# EAGLE design Intercom (EAGLE 6.6.0)

## Sheet 1 of 3
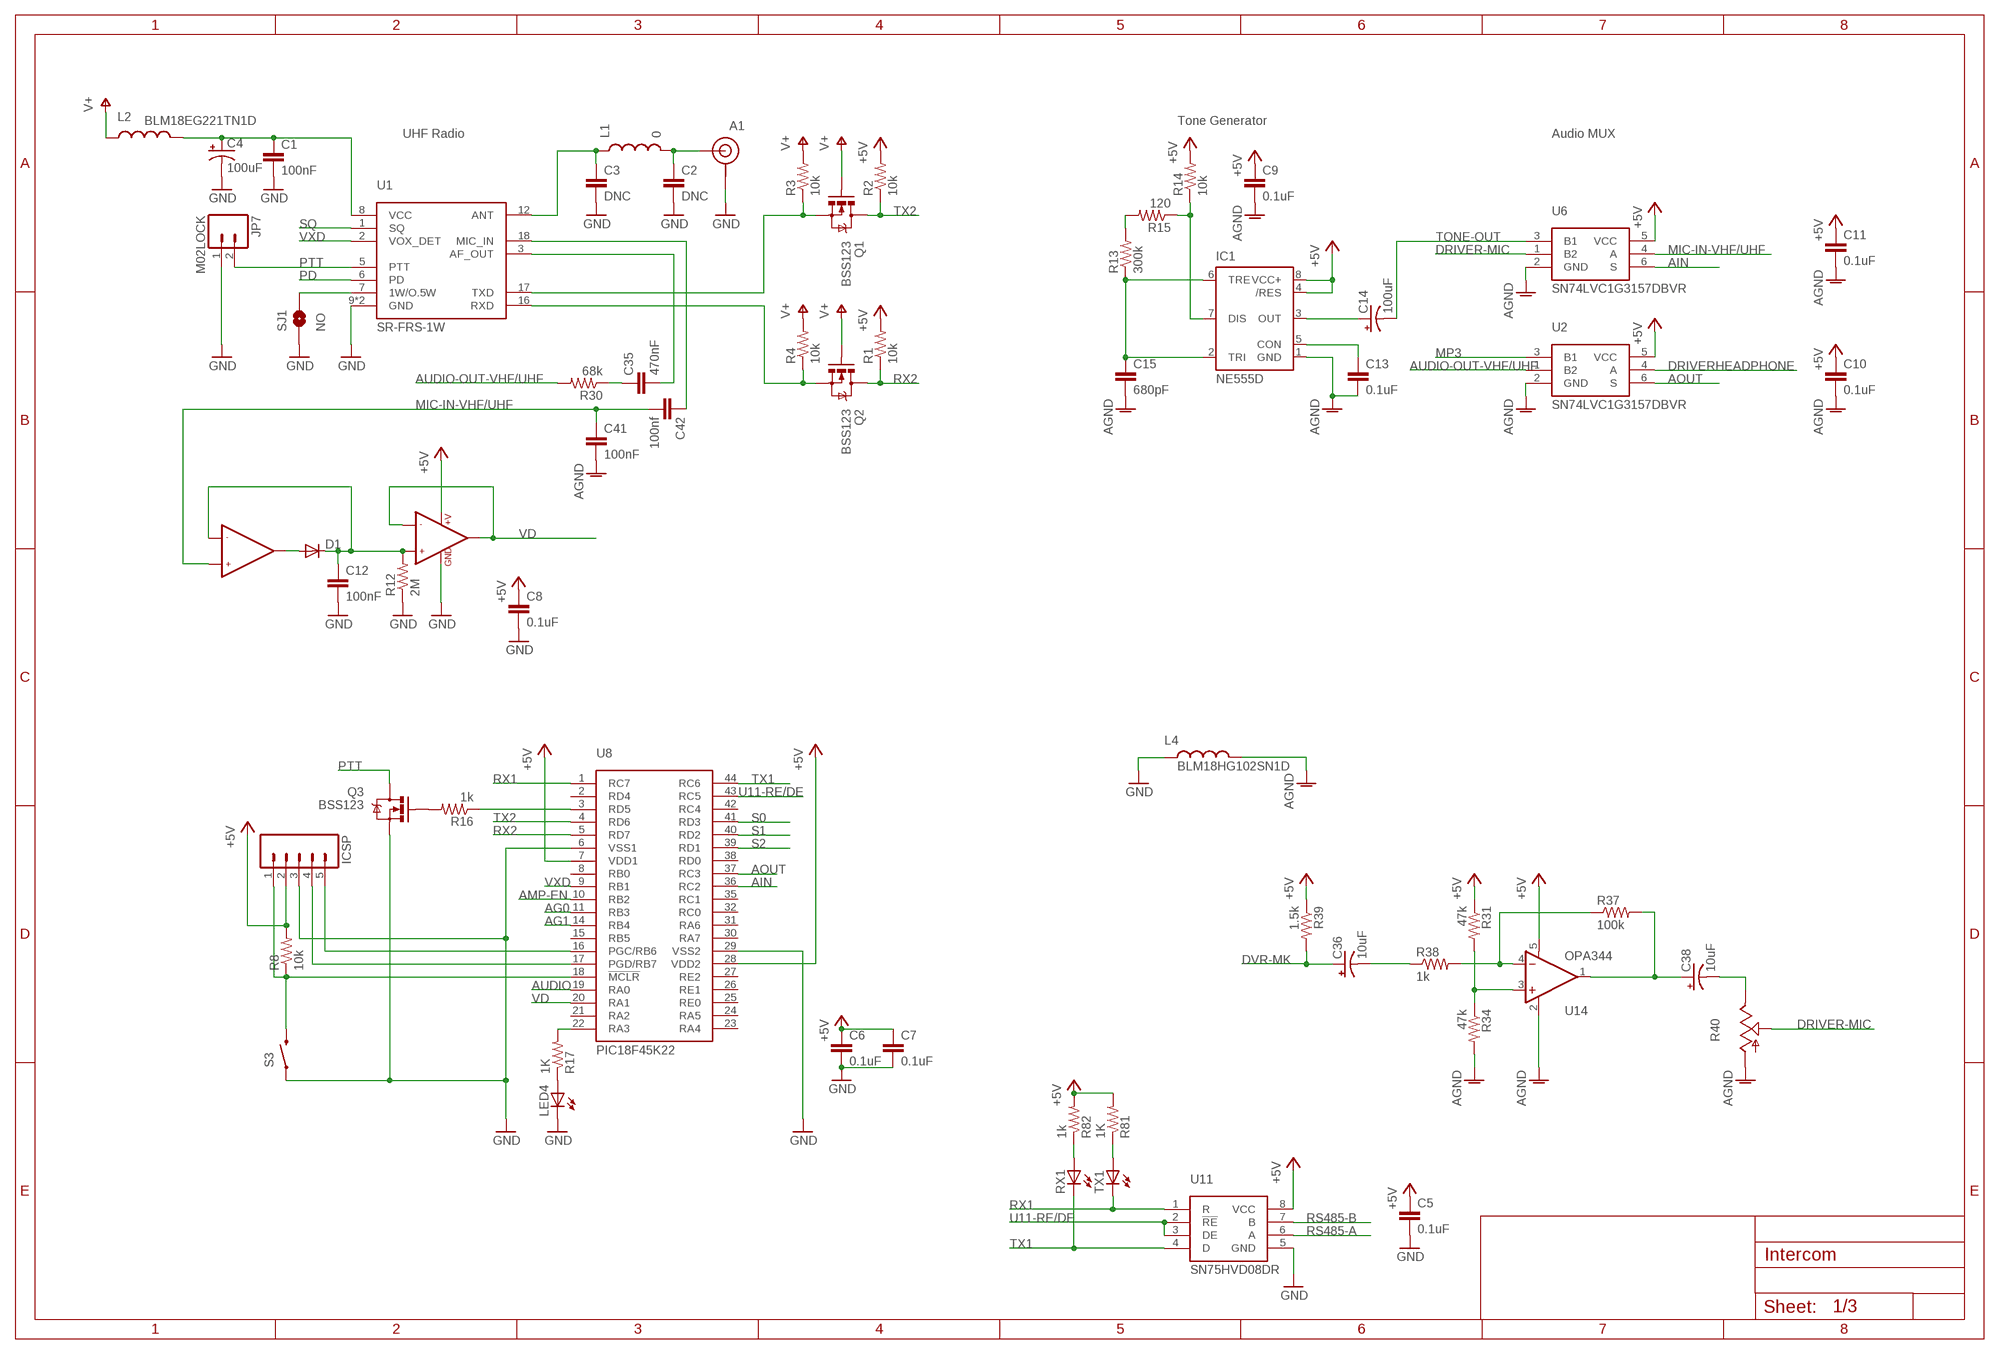
[diagram p0: schematic, sheet 1]

### Parts
A1  CONSMA003.062  [CONSMA003.062]
C1  100nF  CAP0805  [0805]
C2  DNC  CAP0805  [0805]
C3  DNC  CAP0805  [0805]
C4  100uF  CAP_POL1206  [EIA3216]
C5  0.1uF  CAP0805  [0805]
C6  0.1uF  CAP0805  [0805]
C7  0.1uF  CAP0805  [0805]
C8  0.1uF  CAP0805  [0805]
C9  0.1uF  CAP0805  [0805]
C10  0.1uF  CAP0805  [0805]
C11  0.1uF  CAP0805  [0805]
C12  100nF  CAP0805  [0805]
C13  0.1uF  CAP0805  [0805]
C14  100uF  CAP_POL3528-KIT  [EIA3528-KIT]
C15  680pF  CAP0805  [0805]
C35  470nF  CAP0805  [0805]
C36  10uF  CAP_POL1206  [EIA3216]
C38  10uF  CAP_POL1206  [EIA3216]
C41  100nF  CAP0805  [0805]
C42  100nf  CAP0805  [0805]
D1  DIODESOD  [SOD-323]
IC1  NE555D  [SO08]
ICSP  M05LOCK_LONGPADS  [1X05_LOCK_LONGPADS]
JP7  M02LOCK  [1X02_LOCK]
L1  0  INDUCTOR1007  [1007]
L2  BLM18EG221TN1D  INDUCTOR0603  [0603]
L4  BLM18HG102SN1D  INDUCTOR0805  [0805]
LED4  LEDCHIPLED_0805  [CHIPLED_0805]
Q1  BSS123  MOSFET-NCHANNELBSS123LT1G  [SOT23]
Q2  BSS123  MOSFET-NCHANNELBSS123LT1G  [SOT23]
Q3  BSS123  MOSFET-NCHANNELBSS123LT1G  [SOT23]
R1  10k  RESISTOR0805-RES  [0805]
R2  10k  RESISTOR0805-RES  [0805]
R3  10k  RESISTOR0805-RES  [0805]
R4  10k  RESISTOR0805-RES  [0805]
R8  10k  RESISTOR0805-RES  [0805]
R12  2M  RESISTOR0805-RES  [0805]
R13  300k  RESISTOR0805-RES  [0805]
R14  10k  RESISTOR0805-RES  [0805]
R15  120  RESISTOR0805-RES  [0805]
R16  1k  RESISTOR0805-RES  [0805]
R17  1K  R-US_R0805  [R0805]
R30  68k  RESISTOR0805-RES  [0805]
R31  47k  RESISTOR0805-RES  [0805]
R34  47k  RESISTOR0805-RES  [0805]
R37  100k  RESISTOR0805-RES  [0805]
R38  1k  RESISTOR0805-RES  [0805]
R39  1.5k  RESISTOR0805-RES  [0805]
R40  TRIM_US-CA6H  [CA6H]
R81  1K  R-US_R0805  [R0805]
R82  1k  R-US_R0805  [R0805]
RX1  LEDCHIPLED_0805  [CHIPLED_0805]
S3  SWITCH-MOMENTARY-2SIDE_EZ  [TACTILE-PTH-SIDEEZ]
SJ1  NO  SOLDERJUMPERNO  [SJ_2S-NO]
TX1  LEDCHIPLED_0805  [CHIPLED_0805]
U1  SR-FRS-1W  [SR-FRS-1W]
U2  SN74LVC1G3157DBVR  [SOT23-6]
U6  SN74LVC1G3157DBVR  [SOT23-6]
U8  PIC18F45K22  [TQFP-44]
U11  SN75HVD08DR  [SO-8]
U12  LMV358  [SO08]
U14  OPA344  [SOT23-5]

### Nets
+5V: C5.1 C6.1 C7.1 C8.1 C9.1 C10.1 C11.1 IC1.4(/RES) IC1.8(VCC+) ICSP.2 R1.2 R2.2 R8.2 R14.2 R31.1 R39.1 R81.2 R82.2 U2.5(VCC) U6.5(VCC) U8.7(VDD1) U8.28(VDD2) U11.8(VCC) U12.8(+V) U14.5(V+) ; also sheet 3
AG0: U8.11(RB3)
AG1: U8.14(RB4)
AGND: C9.2 C10.2 C11.2 C13.2 C15.2 C41.2 IC1.1(GND) L4.2 R34.2 R40.A U2.2(GND) U6.2(GND) U14.2(V-) ; also sheet 2,3
AIN: U6.6(S) U8.36(RC2)
AMP-EN: U8.10(RB2)
AOUT: U2.6(S) U8.37(RC3)
AUDIO: U8.19(RA0)
AUDIO-OUT-VHF/UHF: R30.2 U2.1(B2)
DRIVER-MIC: R40.S U6.1(B2)
DRIVERHEADPHONE: U2.4(A)
DVR-MK: C36.A(+) R39.2 ; also sheet 3
GND: A1.G1(GND) A1.G2(GND) A1.G3(GND) A1.G(GND) C1.2 C2.2 C3.2 C4.C(-) C5.2 C6.2 C7.2 C8.2 C12.2 ICSP.3 JP7.1 L4.1 LED4.C Q3.2(S) R12.1 S3.1 SJ1.1 U1.9(GND) U1.10(GND) U8.6(VSS1) U8.29(VSS2) U11.5(GND) U12.4(GND) ; also sheet 2,3
MIC-IN-VHF/UHF: C41.1 C42.2 U6.4(A) U12.5(+IN2)
MP3: U2.3(B1) ; also sheet 2
N$1: C3.1 L1.1 U1.12(ANT)
N$2: A1.S(SIGNAL) C2.1 L1.2
N$3: C1.1 C4.A(+) L2.2 U1.8(VCC)
N$4: SJ1.2 U1.7(1W/O.5W)
N$5: D1.2(A) U12.7(OUT2)
N$6: C15.1 IC1.2(TRI) IC1.6(TRE) R13.1
N$8: Q2.2(S) R4.1 U1.16(RXD)
N$9: Q1.2(S) R3.1 U1.17(TXD)
N$14: C35.2 U1.3(AF_OUT)
N$16: R31.2 R34.1 U14.3(+IN)
N$17: C35.1 R30.1
N$19: R16.1 U8.3(RD5)
N$20: C38.C(-) R40.E
N$21: C12.1 D1.1(C) R12.2 U12.3(+IN1) U12.6(-IN2)
N$22: IC1.7(DIS) R14.1 R15.1
N$23: R13.2 R15.2
N$24: C13.1 IC1.5(CON)
N$25: Q3.1(G) R16.2
N$26: C14.A(+) IC1.3(OUT)
N$27: LED4.A R17.1
N$28: R17.2 U8.22(RA3)
N$33: C38.A(+) R37.2 U14.1(OUT)
N$37: R37.1 R38.2 U14.4(-IN)
N$38: C36.C(-) R38.1
N$40: ICSP.4 U8.17(PGD/RB7)
N$43: ICSP.5 U8.16(PGC/RB6)
N$46: ICSP.1 R8.1 S3.2 U8.18(!MCLR)
N$48: C42.1 U1.18(MIC_IN)
N$86: R81.1 TX1.A
N$87: R82.1 RX1.A
PD: U1.6(PD)
PTT: JP7.2 Q3.3(D) U1.5(PTT)
RS485-A: U11.6(A) ; also sheet 3
RS485-B: U11.7(B) ; also sheet 3
RX1: TX1.C U8.1(RC7) U11.1(R)
RX2: Q2.3(D) R1.1 U8.5(RD7)
S0: U8.41(RD3) ; also sheet 2
S1: U8.40(RD2) ; also sheet 2
S2: U8.39(RD1) ; also sheet 2
SQ: U1.1(SQ)
TONE-OUT: C14.C(-) U6.3(B1)
TX1: RX1.C U8.44(RC6) U11.4(D)
TX2: Q1.3(D) R2.1 U8.4(RD6)
U11-RE/DE: U8.43(RC5) U11.2(!RE) U11.3(DE)
V+: L2.1 Q1.1(G) Q2.1(G) R3.2 R4.2 ; also sheet 3
VD: U8.20(RA1) U12.1(OUT1) U12.2(-IN1)
VXD: U1.2(VOX_DET) U8.9(RB1)
Unconnected: U8.2(RD4) U8.8(RB0) U8.15(RB5) U8.21(RA2) U8.23(RA4) U8.24(RA5) U8.25(RE0) U8.26(RE1) U8.27(RE2) U8.30(RA7) U8.31(RA6) U8.32(RC0) U8.35(RC1) U8.38(RD0) U8.42(RC4)

### Notes on the sheet
- Tone Generator
- UHF Radio | Audio MUX

## Sheet 2 of 3
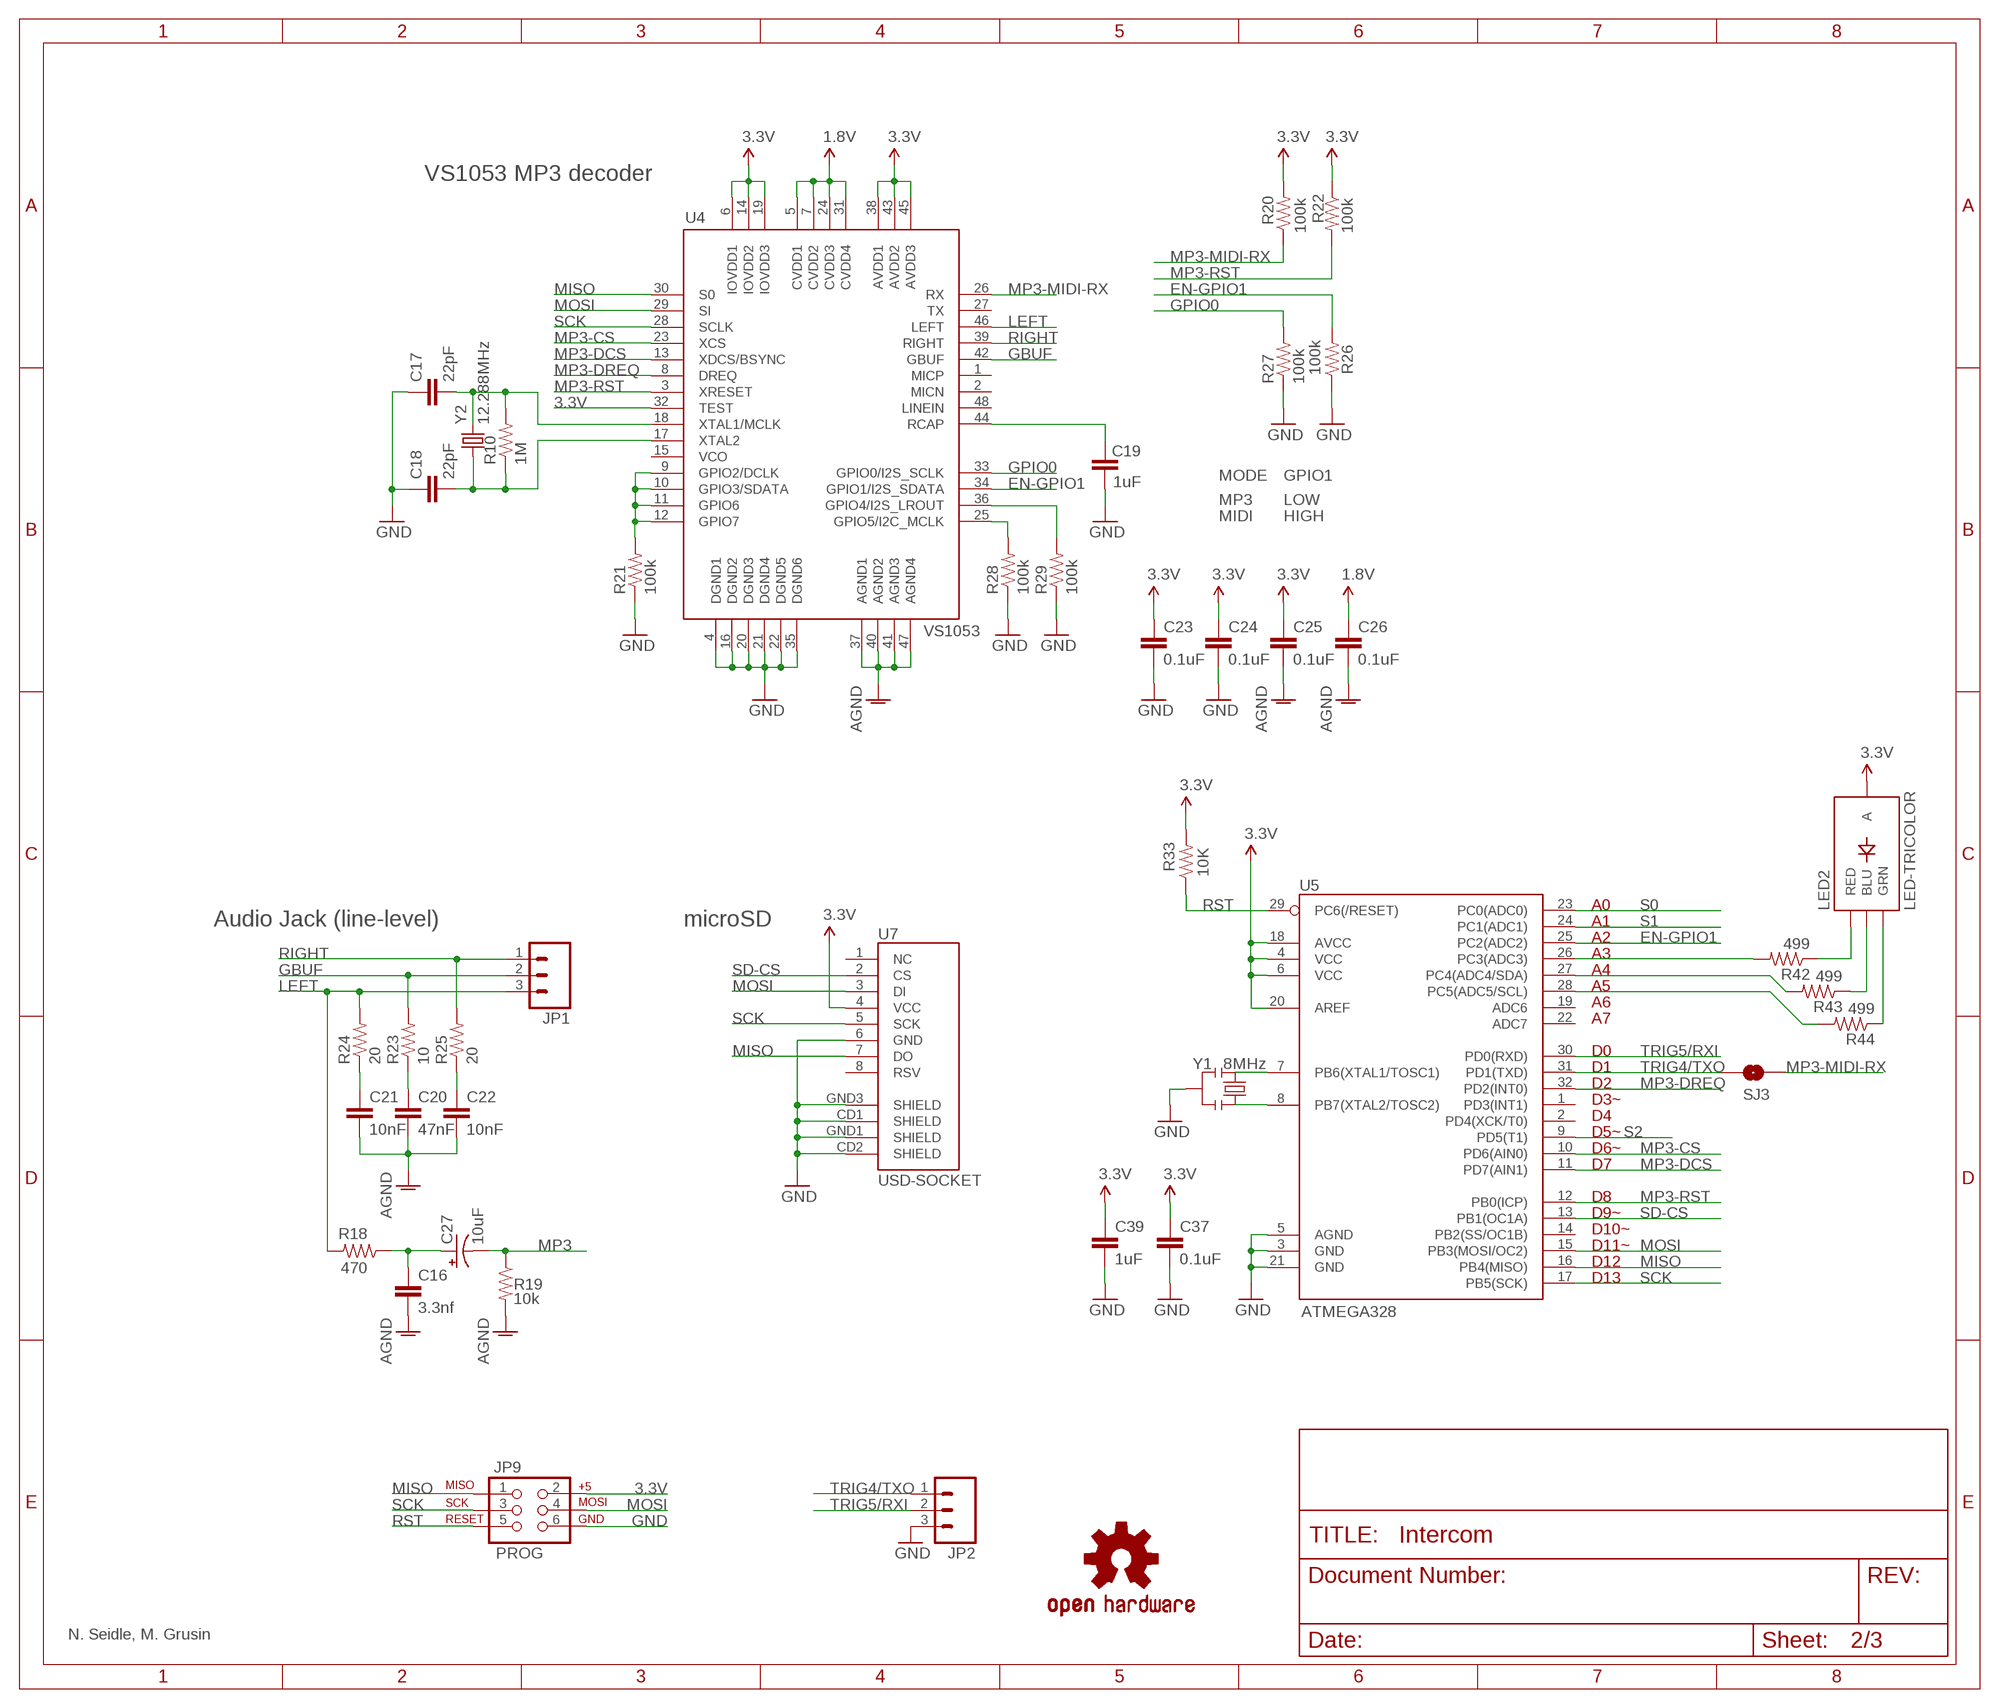
[diagram p1: schematic, sheet 2]

### Parts
C16  3.3nf  CAP0805  [0805]
C17  22pF  CAP0805  [0805]
C18  22pF  CAP0805  [0805]
C19  1uF  CAP0805  [0805]
C20  47nF  CAP0805  [0805]
C21  10nF  CAP0805  [0805]
C22  10nF  CAP0805  [0805]
C23  0.1uF  CAP0805  [0805]
C24  0.1uF  CAP0805  [0805]
C25  0.1uF  CAP0805  [0805]
C26  0.1uF  CAP0805  [0805]
C27  10uF  CPOL-USCT6032  [CT6032]
C37  0.1uF  CAP0805  [0805]
C39  1uF  CAP0805  [0805]
JP1  M03PTH  [1X03]
JP2  M03LOCK_LONGPADS  [1X03_LOCK_LONGPADS]
JP9  PROG  AVR_SPI_PRG_6NS  [2X3-NS]
LED2  LED-TRICOLOR  [LED-TRICOLOR-SMD]
R10  1M  RESISTOR0805-RES  [0805]
R18  470  RESISTOR0805-RES  [0805]
R19  10k  RESISTOR0805-RES  [0805]
R20  100k  RESISTOR0805-RES  [0805]
R21  100k  RESISTOR0805-RES  [0805]
R22  100k  RESISTOR0805-RES  [0805]
R23  10  RESISTOR0805-RES  [0805]
R24  20  RESISTOR0805-RES  [0805]
R25  20  RESISTOR0805-RES  [0805]
R26  100k  RESISTOR0805-RES  [0805]
R27  100k  RESISTOR0805-RES  [0805]
R28  100k  RESISTOR0805-RES  [0805]
R29  100k  RESISTOR0805-RES  [0805]
R33  10K  RESISTOR0805-RES  [0805]
R42  499  RESISTOR0805-RES  [0805]
R43  499  RESISTOR0805-RES  [0805]
R44  499  RESISTOR0805-RES  [0805]
SJ3  SOLDERJUMPERNO  [SJ_2S-NO]
U4  VS1053  VS1033  [LQFP-48]
U5  ATMEGA328  ATMEGA168  [TQFP32-08]
U7  USD-SOCKET  USD-SOCKETNEW  [MICRO-SD-SOCKET-PP]
U$5  OSHW-LOGOM  [OSHW-LOGO-M]
Y1  8MHz  RESONATORSMD  [RESONATOR-SMD]
Y2  12.288MHz  CRYSTAL5X3  [CRYSTAL-SMD-5X3]

### Nets
1.8V: C26.1 U4.5(CVDD1) U4.7(CVDD2) U4.24(CVDD3) U4.31(CVDD4) ; also sheet 3
3.3V: C23.1 C24.1 C25.1 C37.1 C39.1 JP9.2 LED2.A R20.2 R22.1 R33.2 U4.6(IOVDD1) U4.14(IOVDD2) U4.19(IOVDD3) U4.32(TEST) U4.38(AVDD1) U4.43(AVDD2) U4.45(AVDD3) U5.4(VCC) U5.6(VCC) U5.18(AVCC) U5.20(AREF) U7.4(VCC) ; also sheet 3
AGND: C16.2 C20.2 C21.2 C22.2 C25.2 C26.2 R19.2 U4.37(AGND1) U4.40(AGND2) U4.41(AGND3) U4.47(AGND4) ; also sheet 1,3
EN-GPIO1: R26.2 U4.34(GPIO1/I2S_SDATA) U5.25(PC2(ADC2))
G1: R21.2 U4.9(GPIO2/DCLK) U4.10(GPIO3/SDATA) U4.11(GPIO6) U4.12(GPIO7)
G2: R28.2 U4.25(GPIO5/I2C_MCLK)
GBUF: JP1.2 R23.2 U4.42(GBUF)
GND: C17.1 C18.1 C19.1 C23.2 C24.2 C37.2 C39.2 JP2.3 JP9.6 R21.1 R26.1 R27.1 R28.1 R29.1 U4.4(DGND1) U4.16(DGND2) U4.20(DGND3) U4.21(DGND4) U4.22(DGND5) U4.35(DGND6) U5.3(GND) U5.5(AGND) U5.21(GND) U7.6(GND) U7.CD1(SHIELD) U7.CD2(SHIELD) U7.GND1(SHIELD) U7.GND3(SHIELD) Y1.2 ; also sheet 1,3
GPIO0: R27.2 U4.33(GPIO0/I2S_SCLK)
LEFT: JP1.3 R18.2 R24.2 U4.46(LEFT)
MISO: JP9.1 U4.30(S0) U5.16(PB4(MISO)) U7.7(DO)
MOSI: JP9.4 U4.29(SI) U5.15(PB3(MOSI/OC2)) U7.3(DI)
MP3: C27.- R19.1 ; also sheet 1
MP3-CS: U4.23(XCS) U5.10(PD6(AIN0))
MP3-DCS: U4.13(XDCS/BSYNC) U5.11(PD7(AIN1))
MP3-DREQ: U4.8(DREQ) U5.32(PD2(INT0))
MP3-MIDI-RX: R20.1 SJ3.1 U4.26(RX)
MP3-RST: R22.2 U4.3(XRESET) U5.12(PB0(ICP))
N$18: C17.2 R10.2 U4.18(XTAL1/MCLK) Y2.3
N$29: C18.2 R10.1 U4.17(XTAL2) Y2.1
N$30: C16.1 C27.+ R18.1
N$32: C19.2 U4.44(RCAP)
N$34: C22.1 R25.1
N$35: C21.1 R24.1
N$36: C20.1 R23.1
N$41: U5.7(PB6(XTAL1/TOSC1)) Y1.1
N$42: U5.8(PB7(XTAL2/TOSC2)) Y1.3
N$47: LED2.R(RED) R42.1
N$49: LED2.B(BLU) R43.1
N$50: LED2.G(GRN) R44.1
N$51: R42.2 U5.26(PC3(ADC3))
N$52: R43.2 U5.27(PC4(ADC4/SDA))
N$53: R44.2 U5.28(PC5(ADC5/SCL))
N$73: R29.2 U4.36(GPIO4/I2S_LROUT)
RIGHT: JP1.1 R25.2 U4.39(RIGHT)
RST: JP9.5 R33.1 U5.29(PC6(/RESET))
S0: U5.23(PC0(ADC0)) ; also sheet 1
S1: U5.24(PC1(ADC1)) ; also sheet 1
S2: U5.9(PD5(T1)) ; also sheet 1
SCK: JP9.3 U4.28(SCLK) U5.17(PB5(SCK)) U7.5(SCK)
SD-CS: U5.13(PB1(OC1A)) U7.2(CS)
TRIG4/TXO: JP2.1 SJ3.2 U5.31(PD1(TXD))
TRIG5/RXI: JP2.2 U5.30(PD0(RXD))
Unconnected: U4.1(MICP) U4.2(MICN) U4.15(VCO) U4.27(TX) U4.48(LINEIN) U5.1(PD3(INT1)) U5.2(PD4(XCK/T0)) U5.14(PB2(SS/OC1B)) U5.19(ADC6) U5.22(ADC7) U7.1(NC) U7.8(RSV)

### Notes on the sheet
- VS1053 MP3 decoder
- MODE | GPIO1
- MP3 | LOW
- MIDI | HIGH
- A0
- Audio Jack (line-level) | microSD | A1
- A2
- A3
- A4
- A5
- A6
- A7
- D0
- D1
- D2
- D3~
- D4
- D5~
- D6~
- D7
- D8
- D9~
- D10~
- D11~
- D12
- D13
- N. Seidle, M. Grusin

## Sheet 3 of 3
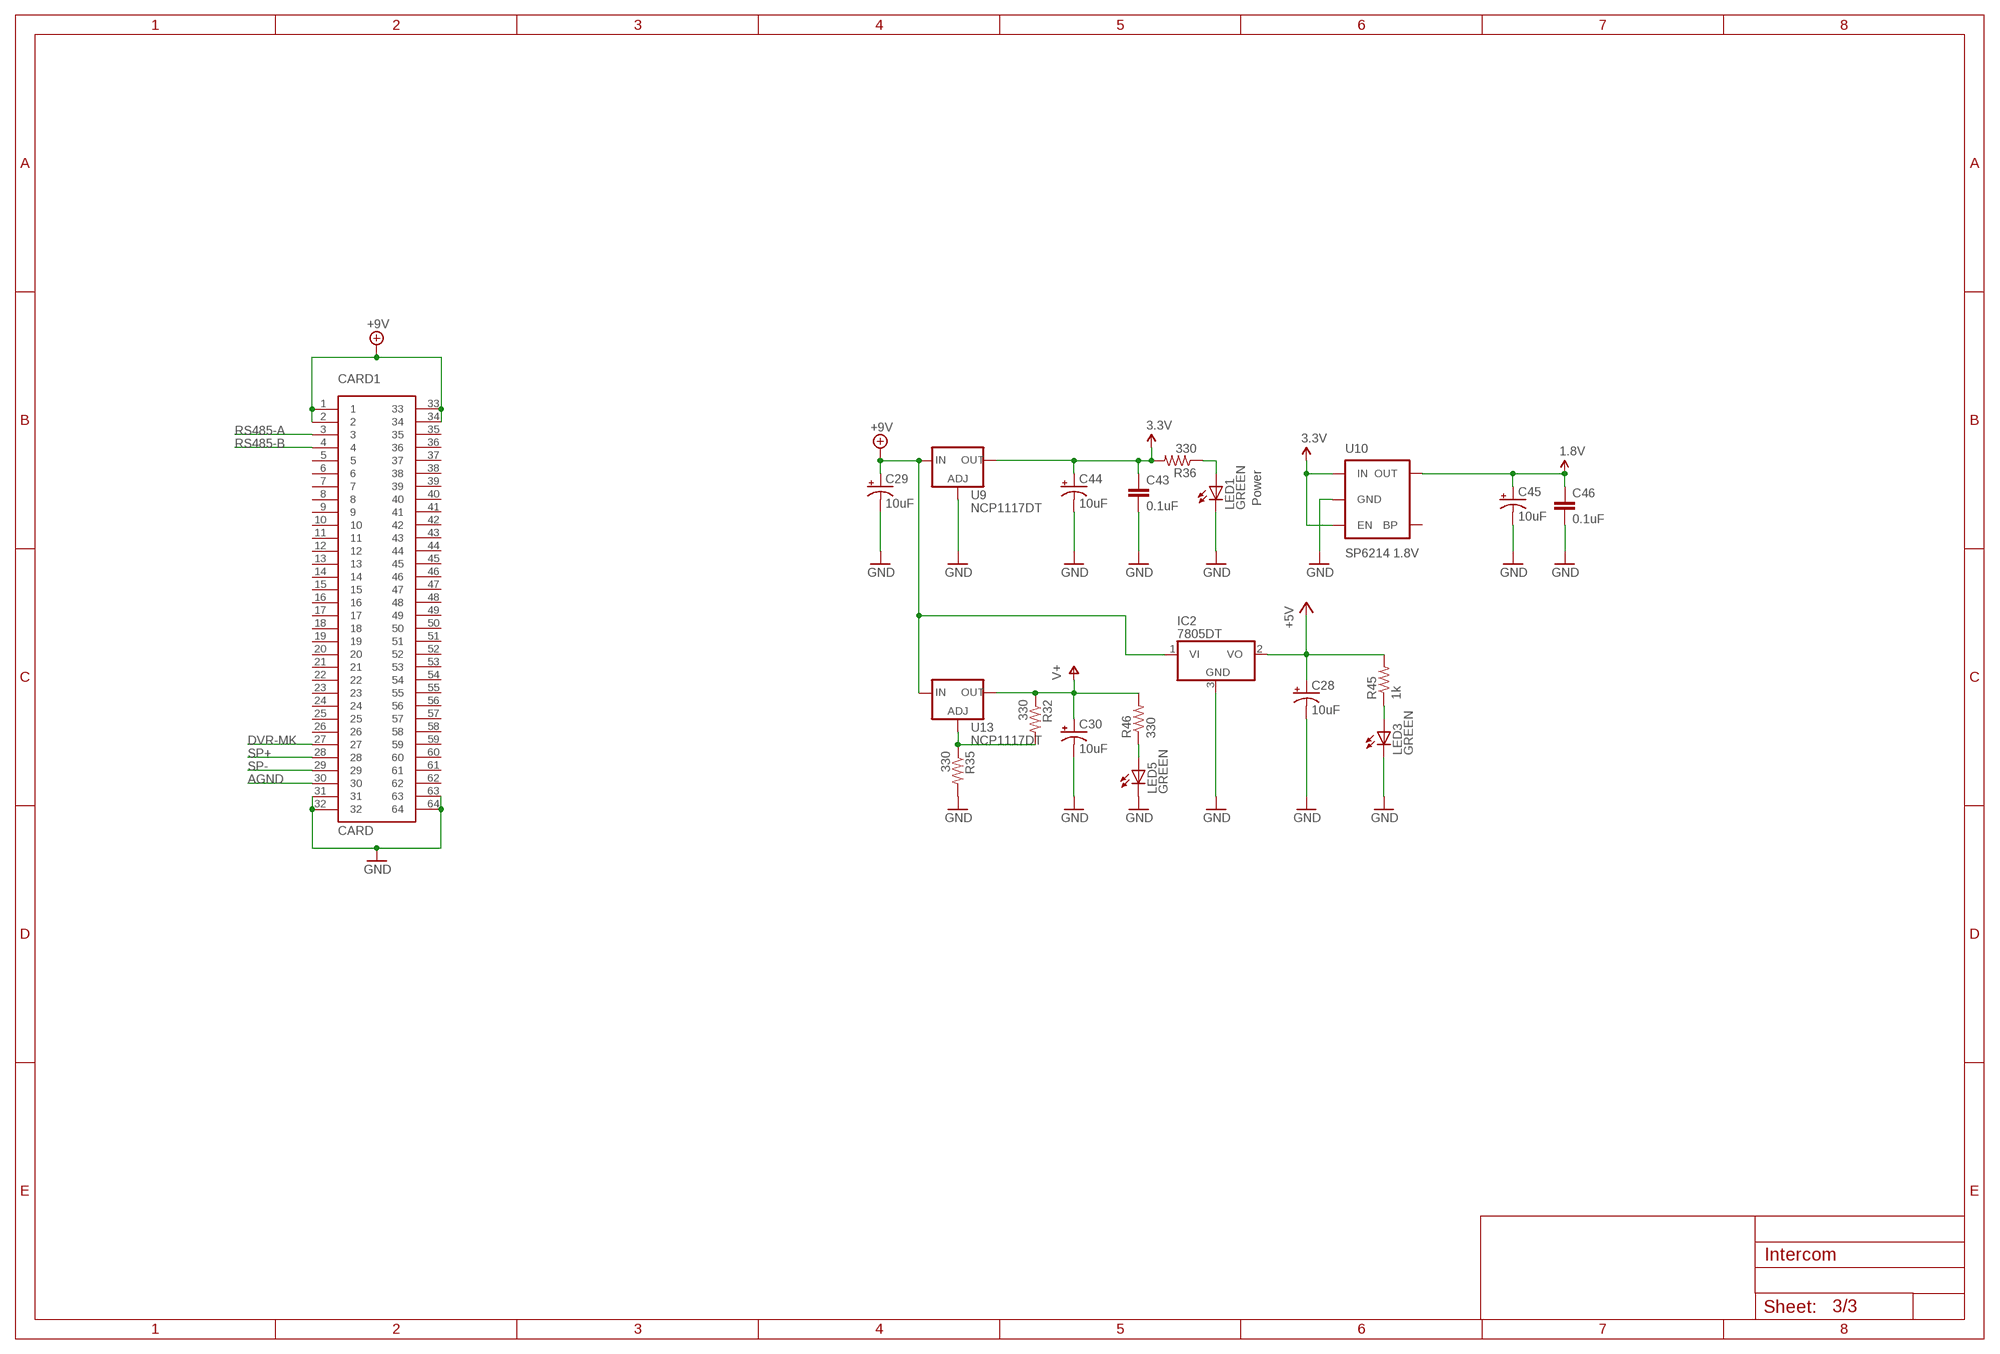
[diagram p2: schematic, sheet 3]

### Parts
C28  10uF  CAP_POL1206  [EIA3216]
C29  10uF  CAP_POL7343  [EIA7343]
C30  10uF  CAP_POL1206  [EIA3216]
C43  0.1uF  CAP0805  [0805]
C44  10uF  CAP_POL1206  [EIA3216]
C45  10uF  CAP_POL1206  [EIA3216]
C46  0.1uF  CAP0805  [0805]
CARD1  CARD  [CARD-64]
IC2  7805DT  [TO252]
LED1  GREEN  LEDCHIPLED_0805  [CHIPLED_0805]
LED3  GREEN  LEDCHIPLED_0805  [CHIPLED_0805]
LED5  GREEN  LEDCHIPLED_0805  [CHIPLED_0805]
R32  330  RESISTOR0805-RES  [0805]
R35  330  RESISTOR0805-RES  [0805]
R36  330  RESISTOR0805-RES  [0805]
R45  1k  RESISTOR0805-RES  [0805]
R46  330  RESISTOR0805-RES  [0805]
U9  NCP1117DT  V_REG_317DPACK  [V-REG_DPACK]
U10  SP6214 1.8V  V_REG_LDOSMD2  [SC70]
U13  NCP1117DT  V_REG_317DPACK  [V-REG_DPACK]

### Nets
1.8V: C45.A(+) C46.1 U10.5(OUT) ; also sheet 2
3.3V: C43.1 C44.A(+) R36.2 U9.4(OUT) U10.1(IN) U10.3(EN) ; also sheet 2
+5V: C28.A(+) IC2.2(VO) R45.2 ; also sheet 1
+9V: C29.A(+) CARD1.1 CARD1.2 CARD1.33 CARD1.34 IC2.1(VI) U9.3(IN) U13.3(IN)
AGND: CARD1.30 ; also sheet 1,2
DVR-MK: CARD1.27 ; also sheet 1
GND: C28.C(-) C29.C(-) C30.C(-) C43.2 C44.C(-) C45.C(-) C46.2 CARD1.31 CARD1.32 CARD1.63 CARD1.64 IC2.3(GND) LED1.C LED3.C LED5.C R35.2 U9.1(ADJ) U10.2(GND) ; also sheet 1,2
N$31: R32.2 R35.1 U13.1(ADJ)
N$44: LED1.A R36.1
N$54: LED3.A R45.1
N$55: LED5.A R46.1
RS485-A: CARD1.3 ; also sheet 1
RS485-B: CARD1.4 ; also sheet 1
SP+: CARD1.28
SP-: CARD1.29
V+: C30.A(+) R32.1 R46.2 U13.4(OUT) ; also sheet 1
Unconnected: CARD1.5 CARD1.6 CARD1.7 CARD1.8 CARD1.9 CARD1.10 CARD1.11 CARD1.12 CARD1.13 CARD1.14 CARD1.15 CARD1.16 CARD1.17 CARD1.18 CARD1.19 CARD1.20 CARD1.21 CARD1.22 CARD1.23 CARD1.24 CARD1.25 CARD1.26 CARD1.35 CARD1.36 CARD1.37 CARD1.38 CARD1.39 CARD1.40 CARD1.41 CARD1.42 CARD1.43 CARD1.44 CARD1.45 CARD1.46 CARD1.47 CARD1.48 CARD1.49 CARD1.50 CARD1.51 CARD1.52 CARD1.53 CARD1.54 CARD1.55 CARD1.56 CARD1.57 CARD1.58 CARD1.59 CARD1.60 CARD1.61 CARD1.62 U10.4(BP)

### Notes on the sheet
- Power

## Library data of the parts
A1 = FSAE Eletric:CONSMA003.062
C1-C3 C5-C13 C15 C35 C41 C42 = SparkFun-Passives:CAP: Capacitor Standard 0603 ceramic capacitor, and 0.1" leaded capacitor.
C4 C14 C36 C38 = SparkFun-Passives:CAP_POL: Capacitor Polarized These are standard SMD and PTH capacitors. Normally 10uF, 47uF, and 100uF in electrolytic and tantalum varieties. Always verify the external diameter of the through hole cap, it varies with capacity, voltage, and manufacturer. The EIA devices should be standard.
C16-C26 C37 C39 C43 C46 = SparkFun:CAP: Capacitor Standard 0603 ceramic capacitor, and 0.1" leaded capacitor.
C27 = adafruit:CPOL-US: POLARIZED CAPACITOR, American symbol
C28-C30 C44 C45 = SparkFun:CAP_POL: Capacitor Polarized These are standard SMD and PTH capacitors. Normally 10uF, 47uF, and 100uF in electrolytic and tantalum varieties. Always verify the external diameter of the through hole cap, it varies with capacity, voltage, and manufacturer. The EIA devices should be standard.
CARD1 = FSAE Eletric:CARD
D1 = SparkFun-DiscreteSemi:DIODE: Diode These are standard reverse protection diodes and small signal diodes. SMA package can handle up to about 1A. SOD-323 can handle about 200mA. What the SOD-323 package when ordering, there are some mfgs out there that are 5-pin packages.
IC1 = SparkFun-AnalogIC:NE555: General purpose bipolar Timer
IC2 = adafruit:78*: Positive VOLTAGE REGULATOR Added bigger pads to the TO-92 package
ICSP = SparkFun-Connectors:M05: Header 5 Standard 5-pin 0.1" header. Use with straight break away headers (SKU : PRT-00116), right angle break away headers (PRT-00553), swiss pins (PRT-00743), machine pins (PRT-00117), and female headers (PRT-00115). Molex polarized connector foot print use with SKU : PRT-08230 with associated crimp pins and housings.
JP1 JP2 = SparkFun-Connectors:M03: Header 3 Standard 3-pin 0.1" header. Use with straight break away headers (SKU : PRT-00116), right angle break away headers (PRT-00553), swiss pins (PRT-00743), machine pins (PRT-00117), and female headers (PRT-00115). Molex polarized connector foot print use with SKU : PRT-08232 with associated crimp pins and housings.
JP7 = SparkFun-Connectors:M02: Standard 2-pin 0.1" header. Use with - straight break away headers ( PRT-00116) - right angle break away headers (PRT-00553) - swiss pins (PRT-00743) - machine pins (PRT-00117) - female headers (PRT-00115) Molex polarized connector foot print use with: PRT-08233 with associated crimp pins and housings. 2.54_SCREWTERM for use with PRT-10571. 3.5mm Screw Terminal footprints for PRT-08084 5mm Screw Terminal footprints for use with PRT-08433
JP9 = SparkFun:AVR_SPI_PRG_6: AVR ISP 6 Pin This is the reduced ISP connector for AVR programming. Common on Arduino. This footprint will take up less PCB space and can be used with a 10-pin to 6-pin adapter such as SKU: BOB-08508
L1 L2 L4 = SparkFun-Passives:INDUCTOR: Inductors Basic Inductor/Choke - 0603 and 1206. Footprints are not proven and vary greatly between part numbers. SRN6045- 33uH, 20% 1.4A SDR0403-560KL - 56uH, 10%, 500mA RMS/740mA peak
LED1 LED3-LED5 RX1 TX1 = adafruit:LED: LED OSRAM: - CHIPLED LG R971, LG N971, LY N971, LG Q971, LY Q971, LO R971, LY R971 LH N974, LH R974 LS Q976, LO Q976, LY Q976 LO Q996 - Hyper CHIPLED LW Q18S LB Q993, LB Q99A, LB R99A - SideLED LS A670, LO A670, LY A670, LG A670, LP A670 LB A673, LV A673, LT A673, LW A673 LH A674 LY A675 LS A676, LA A676, LO A676, LY A676, LW A676 LS A679, LY A679, LG A679 - Hyper Micro SIDELED® LS Y876, LA Y876, LO Y876, LY Y876 LT Y87S - SmartLED LW L88C, LW L88S LB L89C, LB L89S, LG L890 LS L89K, LO L89K, LY L89K LS L896, LA L896, LO L896, LY L896 - TOPLED LS T670, LO T670, LY T670, LG T670, LP T670 LSG T670, LSP T670, LSY T670, LOP T670, LYG T670 LG T671, LOG T671, LSG T671 LB T673, LV T673, LT T673, LW T673 LH T674 LS T676, LA T676, LO T676, LY T676, LB T676, LH T676, LSB T676, LW T676 LB T67C, LV T67C, LT T67C, LS T67K, LO T67K, LY T67K, LW E67C LS E67B, LA E67B, LO E67B, LY E67B, LB E67C, LV E67C, LT E67C LW T67C LS T679, LY T679, LG T679 LS T770, LO T770, LY T770, LG T770, LP T770 LB T773, LV T773, LT T773, LW T773 LH T774 LS E675, LA E675, LY E675, LS T675 LS T776, LA T776, LO T776, LY T776, LB T776 LHGB T686 LT T68C, LB T68C - Hyper Mini TOPLED® LB M676 - Mini TOPLED Santana® LG M470 LS M47K, LO M47K, LY M47K Source: http://www.osram.convergy.de/
LED2 = SparkFun-LED:LED-TRICOLOR: Tri-Color LED SMD Proven layout and schematic for triple color LED in SMD package - common anode. Spark Fun Electronics SKU : COM-07844
Q1-Q3 = SparkFun-DiscreteSemi:MOSFET-NCHANNEL: Common NMOSFET Parts MFG P/N Store ID Prod ID FDD8780 TRANS-09984 SI7820DN TRANS-11055 FDS6630A IC-08089 2N7002PW TRANS-11151 FQP30N06L COM-10213 TRANS-10060 BSS123LT1G TRANS-08345 BSS138 TRANS-00830 BS170 2N7000; PROD_ID: TRANS-08345
R1-R4 R8 R12-R16 R30 R31 R34 R37-R39 = SparkFun-Passives:RESISTOR: Resistor Basic schematic elements and footprints for 0603, 1206, and PTH resistors.
R10 R18-R29 R32 R33 R35 R36 R42-R46 = SparkFun:RESISTOR: Resistor Basic schematic elements and footprints for 0603, 1206, and PTH resistors.
R17 R81 R82 = adafruit:R-US_: RESISTOR, American symbol
R40 = pot:TRIM_US-: POTENTIOMETER
S3 = SparkFun-Electromechanical:SWITCH-MOMENTARY-2: Various NO switches- pushbuttons, reed, etc
SJ1 = SparkFun-Passives:SOLDERJUMPER: Solder Jumper Standard SMD solder jumper. Used to automate production. Two varients : Normally Open and Normally Closed are the same, but have different paste layers. NC will have a large amount of paste and should jumper during reflow.
SJ3 = SparkFun:SOLDERJUMPER: Solder Jumper Standard SMD solder jumper. Used to automate production. Two varients : Normally Open and Normally Closed are the same, but have different paste layers. NC will have a large amount of paste and should jumper during reflow.
U1 = FSAE Eletric:SR-FRS-1W
U2 U6 = FSAE Eletric:SN74LVC1G3157DBVR
U4 = SparkFun:VS1033
U5 = SparkFun:ATMEGA168
U7 = SparkFun:USD-SOCKET: microSD Socket Push-push type uSD socket. Schematic element and footprint production proven. Spark Fun Electronics SKU : PRT-00127. tDoc lines correctly indicate media card edge positions when inserting (unlocked, locked, depressed).
U8 = FSAE Eletric:PIC18F45K22
U9 U13 = SparkFun-PowerIC:V_REG_317: Voltage Regulator Standard LM317 adjustable voltage regulator. AOI (Adjust Output Input). Google 'LM317 Calculator' for easy to use app to get the two resistor values needed. 240/720 for 5V output. 240/390 for 3.3V output. Spark Fun Electronics SKU : COM-00527
U10 = SparkFun:V_REG_LDO: Voltage Regulator LDO Standard 150mA LDO voltage regulator in SOT-23 layout. Micrel part MIC5205. BP (by-pass) pin is used to lower output noise with 470pF cap.
U11 = FSAE Eletric:SN75HVD08DR
U12 = SparkFun-AnalogIC:LMV358: Jellybean rail-to-rail output op-amp; PROD_ID: IC-09657
U14 = SparkFun-AnalogIC:OPA344: Single gate rail-to-rail output op-amp. Inputs extend 300mV past rails.
U$5 = SparkFun:OSHW-LOGO: Open Source Hardware Logo This logo indicates the piece of hardware it is found on incorporates a OSHW license and/or adheres to the definition of open source hardware found here: http://freedomdefined.org/OSHW
Y1 = SparkFun:RESONATOR: Resonator Small SMD resonator. This is the itty bitty 10/20MHz resonators with built in caps. CSTCE10M0G55 and CSTCE20M0V53. Footprint has been reviewed closely but hasn't been tested yet.
Y2 = SparkFun:CRYSTAL: Crystals Various standard crystals. Proven footprints. Spark Fun Electronics SKU : COM-00534

## Net classes
1 VCC: width 0.254 mm, clearance 0.254 mm

## Board
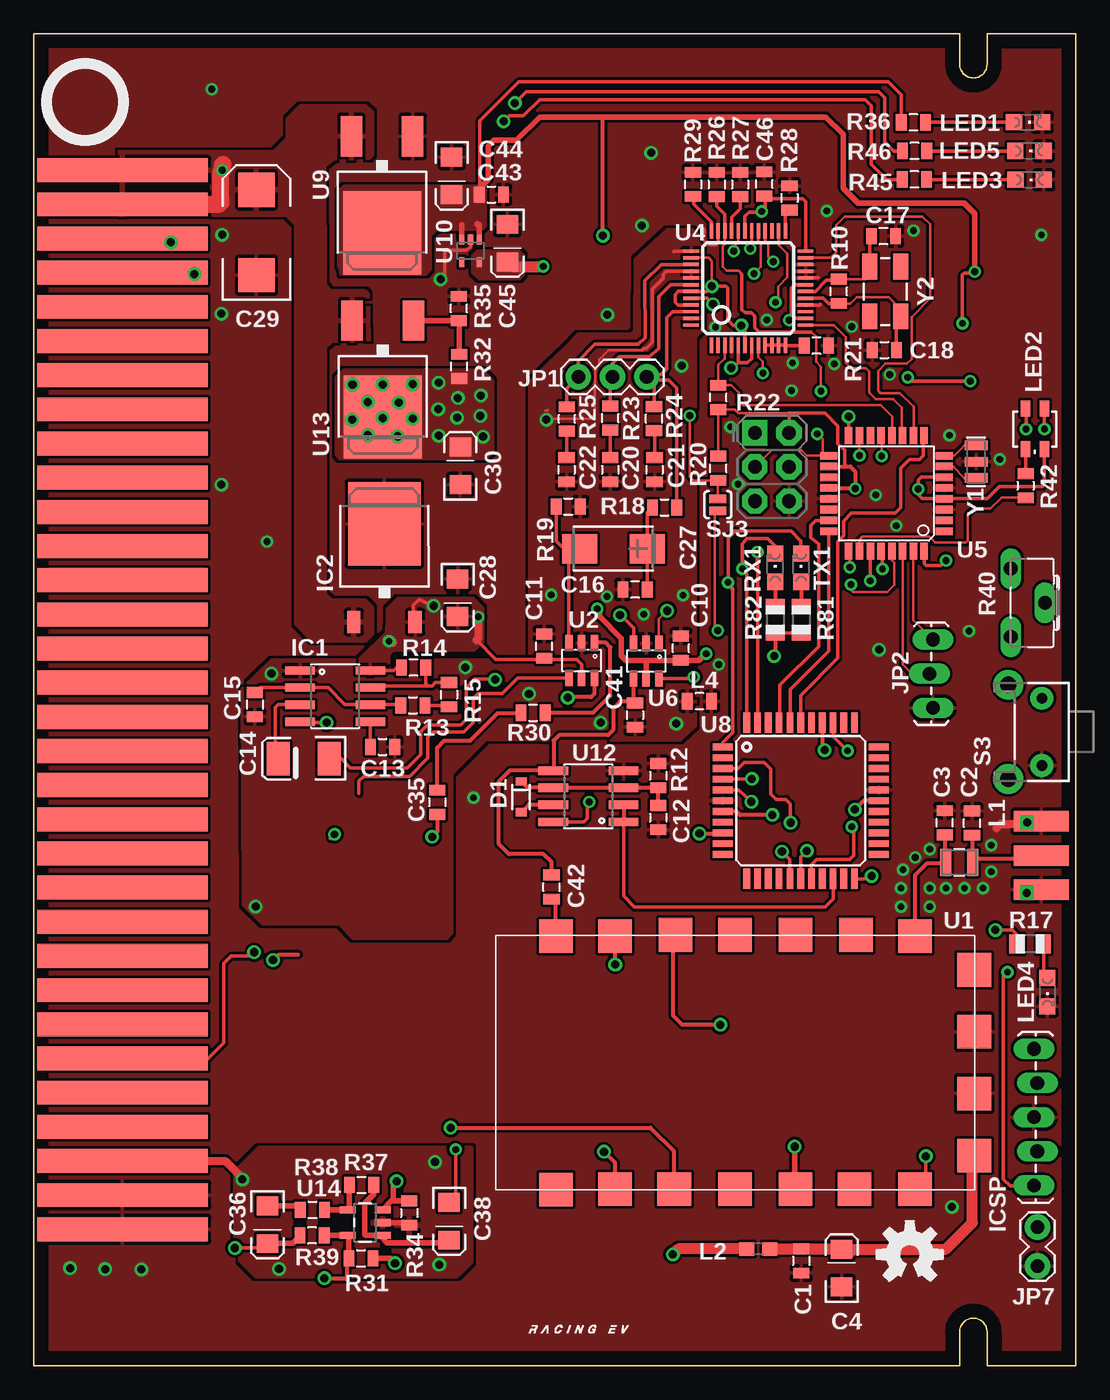
[diagram p3: board, top side]
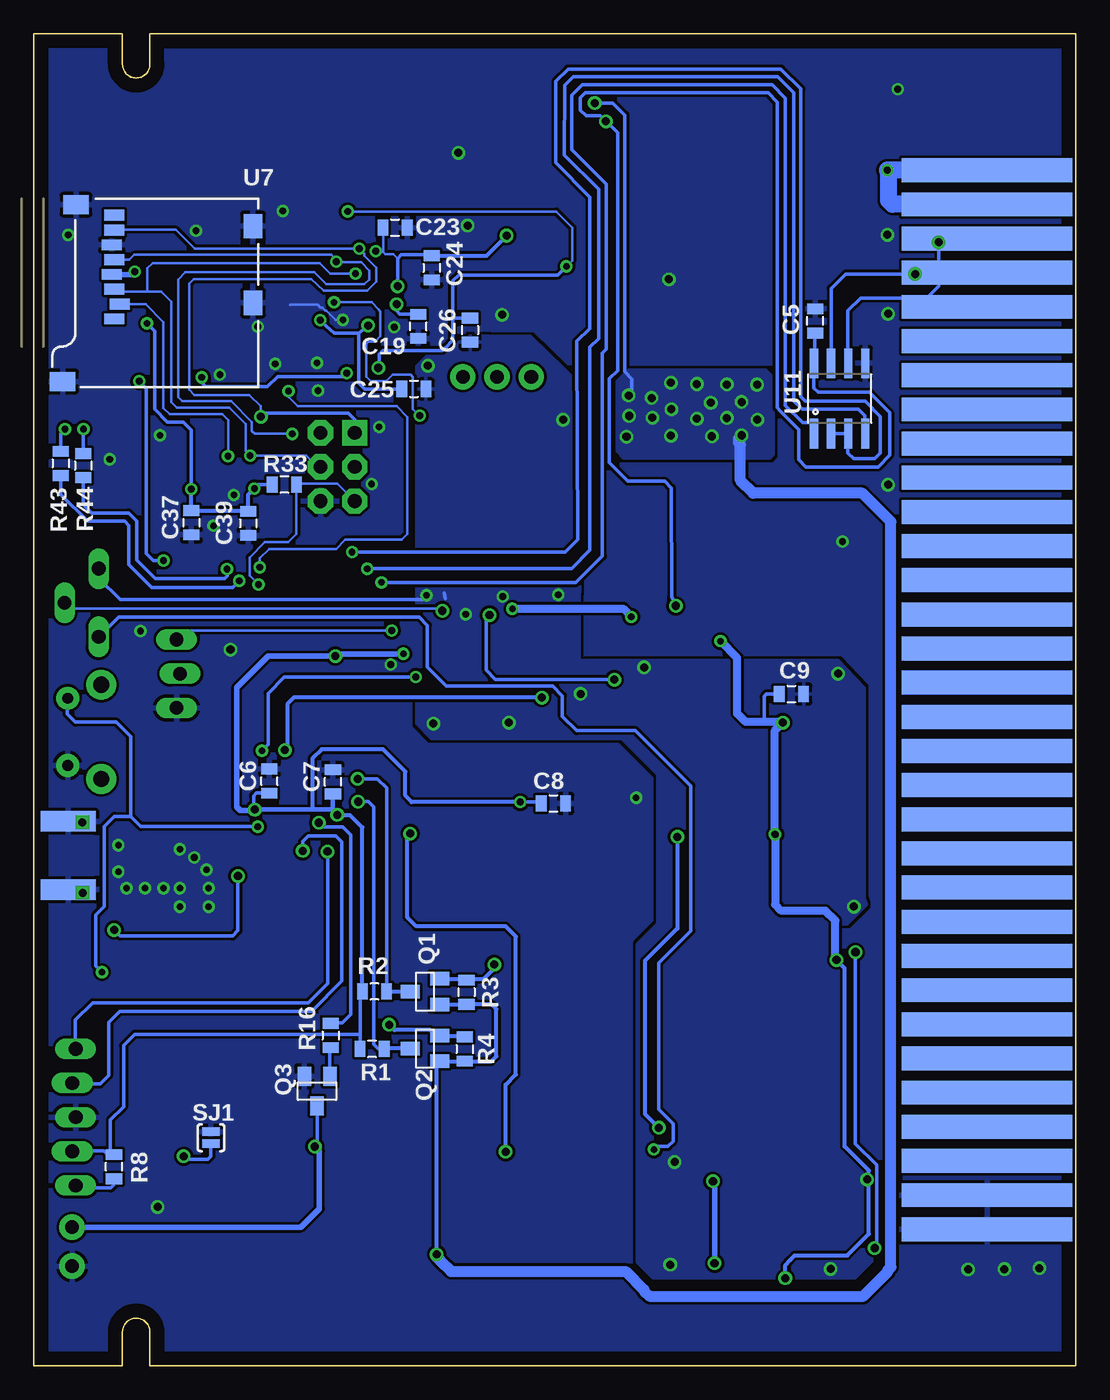
[diagram p4: board, bottom side, seen from below]

Size 77.47 x 99.06 mm. Coordinates in mm from the lower left corner, seen from the top.
Copper layers (1*16): Top 0.035mm / dielectric 1.5mm / Bottom 0.035mm
Design rules "default *": minimum track width 8mil, minimum drill 24mil, track to track 8mil, track to pad 8mil, pad to pad 8mil, via to via 8mil, smd to smd 8mil, copper to edge 40mil, drill to drill 8mil, minimum pad ring 10mil, minimum via ring 8mil, stop-mask expansion 4mil, vias tented up to drill 0mil, thermal gap 10mil

### Footprints (pad centres in the part's own frame; a part is rotated, then mirrored left to right if it is on the bottom)
CONSMA003.062 = smd 4.064 x 1.524: G 0,2.54; G1 0,-2.54; S 0,0 | smd 4.064 x 1.524 bottom: G2 0,2.54; G3 0,-2.54
0805 = smd 0.8 x 1.2: 1 -0.9,0; 2 0.9,0
EIA3216 = smd 1.4 x 1.6: A 1.4,0; C -1.4,0
EIA3528-KIT = smd 1.7 x 2.5: A 1.9,0; C -1.9,0
CT6032 = smd 2.6 x 2.2: + 2.5,0; - -2.5,0
EIA7343 = smd 2.55 x 2.7: A 3.17,0; C -3.17,0
CARD-64 = smd 1.778 x 12.7: 1 10.16,6.604; 2 12.7,6.604; 3 15.24,6.604; 4 17.78,6.604; 5 20.32,6.604; 6 22.86,6.604; 7 25.4,6.604; 8 27.94,6.604; 9 30.48,6.604; 10 33.02,6.604; 11 35.56,6.604; 12 38.1,6.604; 13 40.64,6.604; 14 43.18,6.604; 15 45.72,6.604; 16 48.26,6.604; 17 50.8,6.604; 18 53.34,6.604; 19 55.88,6.604; 20 58.42,6.604; 21 60.96,6.604; 22 63.5,6.604; 23 66.04,6.604; 24 68.58,6.604; 25 71.12,6.604; 26 73.66,6.604; 27 76.2,6.604; 28 78.74,6.604; 29 81.28,6.604; 30 83.82,6.604; 31 86.36,6.604; 32 88.9,6.604 | smd 1.778 x 12.7 bottom: 33 10.16,6.604; 34 12.7,6.604; 35 15.24,6.604; 36 17.78,6.604; 37 20.32,6.604; 38 22.86,6.604; 39 25.4,6.604; 40 27.94,6.604; 41 30.48,6.604; 42 33.02,6.604; 43 35.56,6.604; 44 38.1,6.604; 45 40.64,6.604; 46 43.18,6.604; 47 45.72,6.604; 48 48.26,6.604; 49 50.8,6.604; 50 53.34,6.604; 51 55.88,6.604; 52 58.42,6.604; 53 60.96,6.604; 54 63.5,6.604; 55 66.04,6.604; 56 68.58,6.604; 57 71.12,6.604; 58 73.66,6.604; 59 76.2,6.604; 60 78.74,6.604; 61 81.28,6.604; 62 83.82,6.604; 63 86.36,6.604; 64 88.9,6.604
SOD-323 = smd 0.63 x 0.83: 1 -1.15,0; 2 1.15,0
SO08 = smd 0.61 x 2.21: 1 -1.905,-2.616; 2 -0.635,-2.616; 3 0.635,-2.616; 4 1.905,-2.616; 5 1.905,2.616; 6 0.635,2.616; 7 -0.635,2.616; 8 -1.905,2.616
TO252 = smd 1 x 1.6: 1 -2.28,-4.8; 2 2.28,-4.8 | smd 5.4 x 6.2: 3 0,2.5
1X05_LOCK_LONGPADS = drill 1.016 long: 1 0,0; 2 2.54,-0.254; 3 5.08,0; 4 7.62,-0.254; 5 10.16,0
1X03 = drill 1.016 pad 1.88: 1 0,0; 2 2.54,0; 3 5.08,0
1X03_LOCK_LONGPADS = drill 1.016 long: 1 0,0; 2 2.54,-0.254; 3 5.08,0
1X02_LOCK = drill 1.016 pad 1.88: 1 -0.178,0; 2 2.718,0
2X3-NS = drill 1.016 pad 1.88 square: 1 -2.54,-1.27 | drill 1.016 pad 1.88 octagon: 2 -2.54,1.27; 3 0,-1.27; 4 0,1.27; 5 2.54,-1.27; 6 2.54,1.27
1007 = smd 2 x 0.8: 1 0,1; 2 0,-1
0603 = smd 1.1 x 1: 1 -0.85,0; 2 0.85,0
CHIPLED_0805 = smd 1.2 x 1.2: A 0,-1.05; C 0,1.05
LED-TRICOLOR-SMD = smd 0.7 x 1.2: A 0.7,-1.5; B 0.7,1.5; G -0.7,1.5; R -0.7,-1.5
SOT23 = smd 1 x 1.4: 1 -0.95,-1.1; 2 0.95,-1.1; 3 0,1.1
R0805 = smd 1.1 x 1.4: 1 -1,0; 2 1,0
CA6H = drill 1.016 long: A -2.54,0; E 2.54,0; S 0,2.54
TACTILE-PTH-SIDEEZ = drill 0.8 pad 1.7: 1 -2.5,0; 2 2.5,0 | drill 1.2 pad 2.2: ANCHOR1 -3.5,2.5; ANCHOR2 3.5,2.5
SJ_2S-NO = smd 0.635 x 1.27: 1 -0.45,0; 2 0.45,0
SR-FRS-1W = smd 2.5 x 2.5: 1 0,31.1; 2 0.04,26.72; 3 0.04,22.32; 4 0.04,17.82; 5 0.04,13.32; 6 0.04,8.92; 7 0.04,4.42; 8 2.54,0.02; 9 7.14,0.02; 10 11.74,0.02; 11 16.34,0.02; 12 18.84,4.42; 13 18.94,8.82; 14 18.94,13.32; 15 18.94,17.82; 16 18.94,22.22; 17 18.84,26.72; 18 18.84,31.12
SOT23-6 = smd 0.55 x 1.2: 1 -0.95,-1.3; 2 0,-1.3; 3 0.95,-1.3; 4 0.95,1.3; 5 0,1.3; 6 -0.95,1.3
LQFP-48 = smd 0.254 x 1.143: 1 -2.75,-4.25; 2 -2.25,-4.25; 3 -1.75,-4.25; 4 -1.25,-4.25; 5 -0.75,-4.25; 6 -0.25,-4.25; 7 0.25,-4.25; 8 0.75,-4.25; 9 1.25,-4.25; 10 1.75,-4.25; 11 2.25,-4.25; 12 2.75,-4.25; 25 2.75,4.25; 26 2.25,4.25; 27 1.75,4.25; 28 1.25,4.25; 29 0.75,4.25; 30 0.25,4.25; 31 -0.25,4.25; 32 -0.75,4.25; 33 -1.25,4.25; 34 -1.75,4.25; 35 -2.25,4.25; 36 -2.75,4.25 | smd 1.143 x 0.254: 13 4.25,-2.75; 14 4.25,-2.25; 15 4.25,-1.75; 16 4.25,-1.25; 17 4.25,-0.75; 18 4.25,-0.25; 19 4.25,0.25; 20 4.25,0.75; 21 4.25,1.25; 22 4.25,1.75; 23 4.25,2.25; 24 4.25,2.75; 37 -4.25,2.75; 38 -4.25,2.25; 39 -4.25,1.75; 40 -4.25,1.25; 41 -4.25,0.75; 42 -4.25,0.25; 43 -4.25,-0.25; 44 -4.25,-0.75; 45 -4.25,-1.25; 46 -4.25,-1.75; 47 -4.25,-2.25; 48 -4.25,-2.75
TQFP32-08 = smd 1.27 x 0.559: 1 -4.293,2.8; 2 -4.293,2; 3 -4.293,1.2; 4 -4.293,0.4; 5 -4.293,-0.4; 6 -4.293,-1.2; 7 -4.293,-2; 8 -4.293,-2.8; 17 4.293,-2.8; 18 4.293,-2; 19 4.293,-1.2; 20 4.293,-0.4; 21 4.293,0.4; 22 4.293,1.2; 23 4.293,2; 24 4.293,2.8 | smd 0.559 x 1.27: 9 -2.8,-4.293; 10 -2,-4.293; 11 -1.2,-4.293; 12 -0.4,-4.293; 13 0.4,-4.293; 14 1.2,-4.293; 15 2,-4.293; 16 2.8,-4.293; 25 2.8,4.293; 26 2,4.293; 27 1.2,4.293; 28 0.4,4.293; 29 -0.4,4.293; 30 -1.2,4.293; 31 -2,4.293; 32 -2.8,4.293
MICRO-SD-SOCKET-PP = smd 0.8 x 1.5: 1 -8.94,10.7; 2 -7.84,10.3; 3 -6.74,10.7; 4 -5.64,10.9; 5 -4.54,10.7; 6 -3.44,10.9; 7 -2.34,10.7; 8 -1.24,10.7 | smd 1.8 x 1.4: CD1 -2.05,0.4; CD2 -7.75,0.4 | smd 1.4 x 1.9: GND1 -13.6,14.55; GND3 -0.45,13.55
TQFP-44 = smd 1.5 x 0.5: 1 -5.8,4; 2 -5.8,3.2; 3 -5.8,2.4; 4 -5.8,1.6; 5 -5.8,0.8; 6 -5.8,0; 7 -5.8,-0.8; 8 -5.8,-1.6; 9 -5.8,-2.4; 10 -5.8,-3.2; 11 -5.8,-4; 23 5.8,-4; 24 5.8,-3.2; 25 5.8,-2.4; 26 5.8,-1.6; 27 5.8,-0.8; 28 5.8,0; 29 5.8,0.8; 30 5.8,1.6; 31 5.8,2.4; 32 5.8,3.2; 33 5.8,4 | smd 0.5 x 1.5: 12 -4,-5.8; 13 -3.2,-5.8; 14 -2.4,-5.8; 15 -1.6,-5.8; 16 -0.8,-5.8; 17 0,-5.8; 18 0.8,-5.8; 19 1.6,-5.8; 20 2.4,-5.8; 21 3.2,-5.8; 22 4,-5.8; 34 4,5.8; 35 3.2,5.8; 36 2.4,5.8; 37 1.6,5.8; 38 0.8,5.8; 39 0,5.8; 40 -0.8,5.8; 41 -1.6,5.8; 42 -2.4,5.8; 43 -3.2,5.8; 44 -4,5.8
V-REG_DPACK = smd 1.6 x 3: 1 -2.28,-4.8; 3 2.28,-4.8 | smd 5.8 x 6.2: 4 0,2.38
SC70 = smd 0.4 x 0.75: 1 -0.65,-0.825; 2 0,-0.825; 3 0.65,-0.825; 4 0.65,0.825; 5 -0.65,0.825
SO-8 = smd 0.61 x 2.21: 1 -1.905,-2.616; 2 -0.635,-2.616; 3 0.635,-2.616; 4 1.905,-2.616; 5 1.905,2.616; 6 0.635,2.616; 7 -0.635,2.616; 8 -1.905,2.616
SOT23-5 = smd 0.55 x 1.2: 1 -0.95,-1.3; 2 0,-1.3; 3 0.95,-1.3; 4 0.95,1.3; 5 -0.95,1.3
RESONATOR-SMD = smd 0.7 x 1.7: 1 -1.2,0; 2 0,0; 3 1.2,0
CRYSTAL-SMD-5X3 = smd 1.9 x 1.1: 1 -1.85,-1.15; 2 1.85,-1.15; 3 1.85,1.15; 4 -1.85,1.15

### Placement (x,y rotation side)
A1  74.89,37.95 0 top
C1  57.06,7.81 270 top
C2  69.75,40.36 90 top
C3  67.72,40.39 90 top
C4  60.06,7.28 90 top
C5  19.38,77.7 90 bottom
C6  59.94,43.48 90 bottom
C7  55.22,43.42 90 bottom
C8  38.84,41.82 0 bottom
C9  21.15,49.96 0 bottom
C10  48.11,53.37 90 top
C11  37.95,53.52 90 top
C12  46.43,40.77 270 top
C13  25.93,46.02 0 top
C14  20.08,45.15 180 top
C15  16.45,49.17 270 top
C16  44.7,57.72 180 top
C17  63.17,84 180 top
C18  63.23,75.54 0 top
C19  48.88,77.29 90 bottom
C20  42.86,66.64 270 top
C21  46.15,66.64 270 top
C22  39.61,66.64 270 top
C23  50.6,84.63 0 bottom
C24  47.88,81.65 270 bottom
C25  49.21,72.64 0 bottom
C26  45.03,77.01 270 bottom
C27  43.1,60.76 0 top
C28  31.52,57.11 270 top
C29  16.56,84.28 90 top
C30  31.71,66.93 90 top
C35  30,41.91 270 top
C36  17.37,10.49 270 top
C37  65.75,62.7 270 bottom
C38  30.89,10.76 270 top
C39  61.52,62.65 270 bottom
C41  44.7,48.39 270 top
C42  38.49,35.6 90 top
C43  34.02,87.1 0 top
C44  31.08,88.48 270 top
C45  35.22,83.48 270 top
C46  54.31,87.87 90 top
CARD1  0,99.06 270 top
D1  36.23,42.3 270 top
IC1  22.42,49.8 270 top
IC2  26.07,60.11 0 top
ICSP  74.35,13.41 90 top
JP1  40.49,73.53 0 top
JP2  66.84,54.01 270 top
JP7  74.61,7.59 90 top
JP9  54.88,66.84 270 top
L1  68.8,37.43 90 top
L2  53.86,8.7 0 top
L4  49.48,49.42 180 top
LED1  73.91,92.47 270 top
LED2  74.42,69.67 0 top
LED3  74.03,88.19 270 top
LED4  75.35,27.79 180 top
LED5  74.02,90.34 270 top
Q1  48.37,27.83 90 bottom
Q2  48.37,23.6 90 bottom
Q3  56.4,20.43 180 bottom
R1  52.31,23.57 180 bottom
R2  52.13,27.84 180 bottom
R3  45.3,27.77 270 bottom
R4  45.43,23.56 270 bottom
R8  71.5,14.81 90 bottom
R10  59.84,79.9 90 top
R12  46.43,43.89 270 top
R13  28.19,49.11 0 top
R14  28.24,51.93 180 top
R15  30.87,49.91 270 top
R16  55.38,24.56 270 bottom
R17  74.07,31.38 180 top
R18  46.9,63.83 0 top
R19  39.74,63.89 0 top
R20  50.89,66.75 90 top
R21  58.18,75.86 180 top
R22  50.89,72.01 90 top
R23  42.86,70.47 90 top
R24  46.11,70.43 90 top
R25  39.64,70.41 90 top
R26  50.77,87.83 270 top
R27  52.51,87.83 270 top
R28  56.18,86.83 270 top
R29  49.01,87.85 270 top
R30  37.12,48.56 0 top
R31  24.33,8 0 top
R32  31.62,74.31 90 top
R33  58.84,65.53 180 bottom
R34  27.91,11.37 270 top
R35  31.61,78.63 90 top
R36  65.39,92.46 180 top
R37  24.37,13.45 0 top
R38  20.73,11.61 0 top
R39  20.7,9.7 180 top
R40  72.63,56.74 270 top
R42  73.74,65.44 270 top
R43  75.45,67.11 270 bottom
R44  73.79,66.94 270 bottom
R45  65.47,88.21 180 top
R46  65.48,90.34 180 top
R81  57.05,55.49 270 top
R82  55.12,55.49 270 top
RX1  55.12,59.35 0 top
S3  74.94,47.14 90 top
SJ1  64.29,16.97 270 bottom
SJ3  50.86,64.03 270 top
TX1  57.05,59.35 0 top
U1  69.94,13.11 90 top
U2  40.73,52.45 180 top
U4  53.12,80.14 0 top
U5  63.39,64.87 180 top
U6  45.53,52.41 180 top
U7  60.77,86.79 90 bottom
U8  57.01,42.02 0 top
U9  25.9,86.63 180 top
U10  32.47,82.91 180 top
U11  17.56,71.93 0 bottom
U12  41.24,42.35 90 top
U13  25.95,72.92 180 top
U14  24.64,10.66 90 top
U$1  [L-MS]  33.81,1.61 0 top
U$5  65.13,8.28 0 top
Y1  70.05,67.23 90 top
Y2  63.3,79.88 90 top

### Tracks (layer width: path | path; a pad name or v marks a point on that pad's centre or on a via)
1.8V  (via drill 0.5, 0.6)
  Top 0.203: U4.31 52.87,85.5 53.17,85.8 54.09,85.8 v54.13,85.84 | 35.54,81.75 C45.A | U4.5
  Top 0.254: U4.31 52.87,85.49 53.19,85.8 54.13,85.8 54.39,86.07 54.39,86.88 C46.1 54.48,86.79 57.15,86.79 57.37,86.57 U4.24 | U4.5 52.37,74.59 | 52.37,74.59 51.89,74.21 v51.84,74.21 | U4.7 53.37,74.9 53.06,74.59 52.37,74.59
  Top 0.813: 35.54,81.75 v37.87,81.75
  Bottom 0.203: v54.13,85.84 38.62,85.84 37.43,84.65 37.43,82.19 v37.87,81.75
  Bottom 0.254: 46.3,77.89 46.3,76.26 46.89,75.68 46.91,75.68 47.09,75.5 51.54,75.5 51.79,75.25 51.79,74.26 v51.84,74.21 | 46.3,77.89 46.3,80.68 45.87,81.12 38.51,81.12 v37.87,81.75 | C26.1 46.28,77.91 46.3,77.89
  pour Top (no thermals): 32.63,82.5 32.63,82.55 32.96,82.88 36.11,82.88 36.4,82.59 36.4,81.13 36.12,80.85 33.11,80.85 32.65,81.31 32.65,81.7
3.3V  (via drill 0.5, 0.6)
  Top 0.203: U4.38 50.19,82.39 50.42,82.16 v50.42,80.28 50.44,80.3 | U4.32 52.37,83.53 52.04,83.22 v52.04,82.89 | R20.2 R22.1 52.12,71.11 52.4,70.83 56.13,70.83
  Top 0.254: U10.3 31.84,83.73 | U10.1 | R36.2 64.49,94.51 63.53,95.48 36.06,95.48 33.16,92.58 33.16,87.6 33.16,87.13 C43.1 | v69.04,77.51 69.04,81.13 69.18,81.27 69.85,81.27 v69.95,81.37 | LED2.A 75.12,65.53 74.98,65.39 71.78,65.39 70.87,64.48 U5.4 66.06,64.47 65.76,64.77 v65.76,65.19 65.76,65.85 65.98,66.07 U5.6 | U4.45 47.9,78.89 47.68,79.11 47.68,79.64 47.93,79.9 48.87,79.9 U4.43 50.03,79.89 v50.42,80.28 51.46,80.28 51.59,80.15 51.59,77.79 52.02,77.36 v52.6,77.36 52.87,77.09 U4.6 | U4.19 56.57,80.39 56.31,80.12 56.31,78.04 | 56.31,78.04 56.31,77.89 v56.16,77.76 | U4.14 56.47,77.89 56.31,78.04 | 60.43,66.87 60.27,67.02 60.27,68.09 59.77,68.59 59.77,69.89 58.83,70.83 56.13,70.83 56.15,70.82 JP9.2
  Top 0.305: v42.32,84.04 42.32,92.76 42.21,92.86 | U5.20 59.12,65.24 v61.06,65.24 61.06,66.51 60.7,66.87 60.43,66.87 U5.18
  Top 0.406: 31.84,83.73 U10.3 31.83,84.86 | U10.1 33.12,84.85 32.96,84.85 32.96,84.91 | v69.95,81.37 69.95,85.66 69.18,86.44 61.3,86.44 60.18,87.55 60.18,91.57 58.89,92.86 42.21,92.86 37.63,92.86 35.89,91.12 34.21,91.12 33.78,90.69 33.78,88.23 33.16,87.6
  Bottom 0.203: C23.1 51.5,82.91 | 51.5,82.91 v52.04,82.89 | 51.5,82.91 51.5,82.83 51.33,82.66 50.75,82.66 50.42,82.33
  Bottom 0.254: v65.76,65.19 65.76,69.58 66.36,70.18 67.53,70.18 68.48,71.13 68.48,76.95 v69.04,77.51 | v50.42,80.28 50.42,82.33 50.14,82.61 47.94,82.61 C24.1 | R33.2 60.77,65.53 v61.06,65.24 | C25.1 52.84,72.64 53.31,73.09 53.31,76.8 | 53.31,76.8 v52.6,77.36 | v56.16,77.76 55.7,77.31 55.14,76.8 53.31,76.8
  Bottom 0.305: C24.1 43.8,82.55 v42.32,84.04 | v65.76,65.19 65.75,65.18 C37.1 61.57,63.6 C39.1 61.52,64.78 v61.06,65.24
  Bottom 0.406: U7.4 70.17,81.15 v69.95,81.37
  pour Top (no thermals): 22.91,81.27 29.1,81.27 29.41,81.58 29.41,84.1 29.9,84.58 33.26,84.58 33.5,84.82 33.5,87.46 33.31,87.66 23.11,87.66 22.75,87.29 22.75,81.8 22.86,81.69
+5V  (via drill 0.5, 0.6)
  Top 0.254: R45.2 63.4,88.21 62.27,89.34 62.27,93.7 61.81,94.16 37.6,94.16 36.39,92.94 35.37,92.94 v34.94,92.53 | v29.73,56.52 28.66,57 28.23,56.57 28.23,55.43 IC2.2 | R14.2 27,51.93 26.78,51.71 25.04,51.71 IC1.8 | v21.78,47.83 19.98,47.84 IC1.4 | 33.25,54.78 33.12,54.65 | R39.1 23.28,9.7 23.49,9.49 23.49,8.06 23.27,7.84 | R81.2 R82.2 | U12.8 40.89,40.45 41.15,40.7 41.15,41.77 v41.3,41.92 | 42.16,56.02 v41.88,56.3 | 40.36,52.51 40.33,52.54 38.03,52.54 C11.1 | U2.5 40.73,52.15 40.36,52.51 | 40.36,52.51 34.37,52.51 32.92,53.96
  Top 0.305: 23.27,7.84 23.27,6.55 23.18,6.46 21.65,6.46 v21.6,6.52 | v17.79,30.18 17.82,30.18 18.24,30.59 19.65,30.59 | v54.9,40.97 52.51,40.96 52.23,41.24 51.22,41.24 U8.7 | U8.28 61.7,42.02 v61.04,41.36 | R82.2 55.12,52.85 v55.04,52.77 | 22.07,39.23 v22.35,39.51 v22.38,39.54
  Top 0.406: R39.1 U14.5 23.43,9.61 R31.1 | 45.54,52.47 C10.1 49.46,52.47 49.94,52.95 v49.99,52.95 | 45.54,52.47 44.04,52.47 43.69,52.82 43.69,54.09 42.06,55.72 42.06,56.12 v41.88,56.3 | U6.5 45.53,52.45 45.54,52.47 | 57.15,54.49 R81.2
  Top 0.61: v33.05,55.69 33.05,54.09 32.92,53.96 | v26.42,53.89 26.62,53.89 26.72,53.78
  Bottom 0.254: v29.73,56.52 30.05,57.19 30.06,65.28 30.57,65.79 33.3,65.79 34.67,67.16 34.67,73.39 34.05,74.02 34.05,91.71 34.53,92.19 v34.94,92.53 35.34,92.94 36.39,92.94 36.83,93.38 36.83,94.3 36.47,94.65 22.89,94.65 22.2,93.97 22.2,71.23 21.97,71.01 21.97,70.98 20.6,69.61 20.6,67.37 20.07,66.84 14.71,66.84 13.84,67.7 13.84,70.88 15.37,72.4 19.15,72.4 19.47,72.72 U11.8 19.47,74.79 19.65,74.97 19.53,74.97 19.41,75.1 19.41,76.77 C5.1 | 21.89,47.88 v21.78,47.83 | R2.2 53.21,27.66 R1.2 53.21,24.64 53.2,24.65 69.95,24.65 70.78,23.83 70.78,19.27 71.77,18.28 71.77,15.98 R8.2 71.97,15.71 72.26,16 74.55,16 ICSP.2 | C9.1 23,49.96 | 23,49.96 23.11,49.85 | C6.1 60.91,42.59 61.11,42.38 61.11,41.44 v61.04,41.36 | v41.3,41.92 39.84,41.92 C8.1 | 23,49.96 23,49.94 23.16,49.77 23.16,48.16 23.44,47.88
  Bottom 0.305: v21.6,6.52 21.6,7.49 21.22,7.87 21.22,7.89 20.9,8.2 16.99,8.2 15.39,9.8 15.39,14.53 17.18,16.32 17.18,29.57 v17.79,30.18 17.88,30.26 | R2.2 53.03,40.04 53.94,40.95 54.75,40.95 v54.9,40.97 | 61.09,41.31 v61.04,41.36 | v41.3,41.92 49.38,41.92 49.5,42.05 49.5,42.08 49.83,42.41 49.83,44.18 51.49,45.83 56.06,45.83 56.74,45.15 56.74,41.57 56.54,41.36
  Bottom 0.33: v61.04,41.36 56.54,41.36 55.37,41.36 | 55.37,41.36 55.3,41.36 v54.9,40.97 | C7.1 55.22,41.52 55.37,41.36
  Bottom 0.406: 61.09,41.31 62.13,41.31 62.38,41.57 62.38,50.43 60.02,52.79 55.07,52.79 v55.04,52.77 54.94,52.74 54.74,52.95 v49.99,52.95
  Bottom 0.61: v41.88,56.3 33.65,56.3 v33.05,55.69 | v22.35,39.51 22.35,34.3 21.89,33.85 18.62,33.85 17.88,33.11 17.88,30.26 | v22.38,39.54 22.38,47.23 v21.78,47.83 | 21.89,47.88 23.44,47.88 24.55,47.88 25.17,48.5 25.17,52.64 v26.42,53.89
  pour Top: 26.29,55.58 26.29,56.29 27.06,57.06 32.66,57.06 33.38,56.35 33.38,53.82 32.77,53.21 26.72,53.21 26.39,52.88 26.39,51.83 26.02,51.46 24.49,51.46 24.3,51.65 24.3,52.58 26.25,54.53
+9V  (via drill 0.5)
  Top 1.27: 14.07,89.34 14.02,89.29 v14.02,88.91 13.92,88.81 13.92,86.7 | 13.92,86.7 13.92,86.53 13.75,86.36 CARD1.34 13.58,86.36 13.92,86.7
  Bottom 1.27: CARD1.33 14.01,88.9 v14.02,88.91 13.92,88.81 13.92,86.65 13.63,86.36 CARD1.34
  pour Top: 5.74,85.62 18.86,85.62 19.55,84.94 19.55,55.18 20.75,53.98 24.61,53.98 25.15,54.51 25.15,56.3 24.59,56.86 22.11,56.86 21.62,57.35 21.62,75.74 22.11,76.24 24.88,76.26 24.8,79.67 24.59,79.88 22.06,79.88 21.6,80.34 21.58,89.23 21.81,89.46 22.29,89.81 24.83,89.84 25.12,90.13 25.12,93.18 24.66,93.64 19.9,93.64 18.92,92.66 18.92,91.22 17.91,90.21 6.32,90.21 5.54,89.42
AGND  (via drill 0.5, 0.6)
  Top 0.203: 45.24,75.53 42.75,75.53 42.04,74.82 42.04,74.49 41.73,74.18 41.73,73.14 41.71,73.11 41.71,70.75 41.38,70.42 38.28,70.4 v38.11,70.36 | 38.2,71.08 38.04,71.04
  Top 0.254: U4.37 47.62,82.89 47.57,82.84 | U4.40 47.03,81.39 46.79,81.14 46.79,80.86 45.97,80.05 45.97,76.09 45.54,75.65 45.36,75.65 45.24,75.53
  Top 0.406: U14.2 27.73,10.66 R34.2
  Top 0.61: CARD1.30 14.24,15.24 15.32,14.16
  Bottom 0.254: R40.A 72.63,58.56 71.02,57 48.48,57 48.55,57.43 | 46.88,57.05 46.95,57.48
  other vias: 16.5,34.15 17.68,51.47 47.76,47.75 15.52,13.87 29.83,15.16 18.24,7.21 30.15,7.53 32.09,51.93 48.27,57.3 45.35,55.88 38.47,57.33 42.61,57.2 36.82,49.96 42.15,47.83 48.17,74.37
  pour Top: 37.83,46.53 48.04,46.53 49.19,47.59 49.19,76.5 49.73,77.05 49.73,83.55 49,84.29 47.09,84.29 44.7,82.09 44.69,76.77 44.41,76.52 40.51,76.54 39.46,75.46 38.25,74.32 37.41,73.48 37.41,73.52 36.88,72.99 36.88,47.54 37.41,47
  pour Top (rank 3): 42.61,52.5 17.69,52.49 15.52,50.37 15.6,34.29 17.03,32.85 22.71,32.85 23.76,31.8 30.7,31.8 31.09,32.19 31.09,43.99 33.62,46.53 43.8,46.56
  pour Bottom: 15.58,34.3 15.58,34.29 17.01,32.87 22.69,32.87 23.71,31.85 30.66,31.85 31.06,32.27 31.06,43.97 33.76,46.66 47.9,46.66 49.01,47.76 49.01,74.35 46.74,76.62 40.51,76.52 36.86,72.96 36.91,52.35 36.83,52.45 17.7,52.49 15.72,50.41 15.72,34.67 15.68,34.63
  pour Bottom: 17.06,32.99 17.06,16.56 14.96,14.47 14.96,8.14 16.48,6.62 31.37,6.62 32.52,7.77 32.52,31.28 31.04,32.77 17.88,32.77 17.69,32.96
  pour Top: 16.79,16.17 32.5,16.17 32.5,7.77 31.41,6.68 16.57,6.68 15.01,8.24 15.01,14.39
  pour Top: 37.86,46.74 48.07,46.74 49.19,47.79 49.19,76.71 49.73,77.25 49.73,83.76 49,84.49 47.09,84.49 44.7,82.3 44.69,76.97 44.41,76.72 40.51,76.75 39.46,75.67 38.25,74.52 37.41,73.69 37.41,73.72 36.88,73.19 36.88,47.74 37.41,47.21
AIN  (via drill 0.5)
  Top 0.254: U6.6 48.97,51.11 v49.07,51.22 | v60.5,45.73 59.44,46.8 59.44,47.8 U8.36
  Bottom 0.254: v49.07,51.22 58.83,51.22 60.05,50 60.05,46.19 v60.5,45.73
AOUT  (via drill 0.6)
  Top 0.305: U2.6 41.68,49.97 41.44,49.73 39.75,49.73 v39.7,49.68 | v58.8,45.78 58.8,45.89 58.64,46.05 58.64,47.8 U8.37
  Bottom 0.305: v39.7,49.68 58.14,49.68 58.61,49.21 58.61,45.97 v58.8,45.78
AUDIO-OUT-VHF/UHF
  Top 0.305: R30.2 41.59,48.57 42.86,49.84 42.86,53.43 42.52,53.77 41.7,53.77 U2.1
DRIVER-MIC  (via drill 0.6)
  Top 0.203: U6.1 46.48,55.54 v47.09,56.15
  Bottom 0.203: v47.09,56.15 47.24,56.3 74.73,56.3 R40.S
DRIVERHEADPHONE
  Top 0.254: U2.4 35.99,51.15 34.82,49.99 33.03,49.99 32.68,49.63 32.68,47.84 31.97,47.13 29.69,47.13 29.31,46.75 29.31,45.19 27.97,43.84 24.52,43.84 24.18,43.5 24.18,42.56
DVR-MK  (via drill 0.6)
  Top 0.254: CARD1.27 12.98,22.86 14.15,24.03 14.15,29.91 14.71,30.47 16.09,30.47 v16.38,30.76 | v14.96,8.76 17.05,8.76 C36.A
  Top 0.406: R39.2 19.8,9.68 19.25,9.13 17.41,9.13 C36.A
  Bottom 0.254: v16.38,30.76 16.38,16.52 14.81,14.95 14.81,8.92 v14.96,8.76
EN-GPIO1  (via drill 0.5)
  Top 0.203: U4.34 51.37,83.42 51.23,83.27 51.23,81.72 51.54,81.42 52.4,81.42 52.63,81.19 | 57.81,76.87 58.17,76.52 58.17,74.66 58.52,74.31 v58.52,72.48 | v60.65,59.37 60.65,60.06
  Top 0.254: U4.34 51.37,85.63 50.77,86.23 R26.2 | U5.25 60.59,60.13 60.65,60.06 | 52.63,81.19 52.63,78.55 52.88,78.3 53.34,78.3 53.59,78.04 53.59,77.2 53.92,76.87 57.81,76.87
  Bottom 0.203: v58.52,72.48 58.52,72.05 57.84,71.36 50.49,71.36 49.68,70.55 49.68,61.86 50.11,61.43 54.3,61.43 54.99,60.74 59.97,60.74 60.65,60.06 v60.65,59.37
G1
  Top 0.254: R21.2 55.9,75.86 U4.12 U4.11 U4.10 U4.9
G2
  Top 0.254: U4.25 55.87,85.62 R28.2
GBUF
  Top 0.254: U4.42 47.37,80.39 46.47,79.49 46.47,75.64 45.77,75.03 43.51,75.03 42.99,74.51 42.99,73.57 JP1.2 42.86,73.37 R23.2
GND  (via drill 0.5, 0.6)
  Top 0.203: U4.35 50.87,83.46 50.75,83.34 50.24,83.34 50.22,83.36 50.16,83.36 50.05,83.48 50.03,83.48 49.78,83.72 49.78,84.2 49.83,84.25
  Top 0.254: U10.2 32.47,83.24 32.19,82.96 30.59,82.96 30.54,82.91 30.54,81.09 v30.25,80.8 | U4.16 58.41,78.89 58.46,78.93 | 58.33,80.9 57.39,80.9 U4.20 | 49.83,84.25 49.83,84.5 C23.2
  Top 0.406: C29.C 16.32,81.11 16.32,80.94
  Top 0.61: A1.G3 74.05,35.41 v73.82,35.18 | A1.G 74.82,40.41 v73.85,40.41 73.75,40.31 71.87,40.31 71.55,39.99
  Bottom 0.203: v54.48,77.78 55.03,77.78 55.73,78.47 55.78,78.47 56.01,78.7 56.16,78.7 56.36,78.91 58.4,78.91 58.41,78.89
  Bottom 0.61: v73.82,35.18 74.66,35.18 A1.G3 | A1.G 73.93,40.49 v73.85,40.41
  other vias: 68.25,11.82 8.01,7.18 5.32,7.19 2.72,7.26 13.96,65.52 13.96,78.23 64.47,34.15 64.47,35.52 64.62,36.89 65.53,37.81 66.6,38.42 66.6,34.15 66.6,35.52 67.82,35.52 69.19,35.52 70.56,35.52 71.17,36.74 71.17,38.72 42.65,78.16 45.9,90.2 68.07,69.19 63.63,73.71 74.9,84.1 58.95,85.88 69.52,54.64 32.69,42.24 50.93,52.15 17.35,61.29 13.23,94.92 14.01,84.1 50.67,77.24 62.84,53.25 62.59,64.76 64.11,62.47 51.79,69.81 52.35,65.57 45.21,84.79 60.81,77.27 59.51,74.5 65.41,84.4 71.81,67.41 56.41,74.57 56.34,72.52
  pour Bottom (rank 6): 0,99.06 77.48,99.06 77.48,0 0,0
  pour Top (rank 5): 0,99.06 77.47,99.06 77.47,0 0,0
GPIO0
  Top 0.254: U4.33 51.87,85.42 52.51,86.06 R27.2
LEFT
  Top 0.254: U4.46 47.51,78.39 47.05,77.93 47.05,74.13 46.62,73.7 46.16,73.7 | 46.16,73.7 45.73,73.7 JP1.3 46.11,72.99 R24.2 | R18.2 47.8,72.71 47.21,73.3 46.56,73.3 46.16,73.7
MIC-IN-VHF/UHF
  Top 0.305: U6.4 44.58,49.41 | 44.58,49.41 C41.1 | C42.2 38.49,37.45 37.88,38.06 35.32,38.06 34.58,38.8 34.58,43.45 35.39,44.26 U12.5 38.66,44.3 38.66,46.51 39.05,46.9 42.7,46.9 43.07,47.27 43.07,48.88 43.59,49.41 44.58,49.41
MISO  (via drill 0.5, 0.6)
  Top 0.203: U4.30 53.37,83.18 v53.26,83.07
  Top 0.254: v60.58,70.57 U5.16
  Bottom 0.203: U7.7 71.44,84.48 66.92,84.48 65.51,83.07 v53.26,83.07 52.91,82.72 52.91,82.54 52.02,81.65 51.99,80.63 52.68,79.95 55.91,79.95 56.84,80.81 65.56,80.81 65.91,80.45 65.91,72.58 65.53,72.2 61.44,72.2 60.6,71.36 60.6,70.6
  Bottom 0.254: JP9.1 53.61,70.36 54.1,70.85 60.3,70.85 v60.58,70.57 60.6,70.6
MOSI  (via drill 0.5)
  Top 0.203: U4.29 53.87,83.63 54.05,83.45 54.05,81.72 v53.54,81.22 | v61.38,67.68 U5.15
  Bottom 0.203: 71.45,80.04 U7.3 71.29,79.87 69.09,79.87 | JP9.4 56.36,66.84 57.2,67.68 v61.38,67.68 61.71,68.01 61.71,70.03 62.94,71.26 66.81,71.26 67.23,71.68 67.23,79.13 67.97,79.87 69.09,79.87 | v53.54,81.22 55.42,81.22 56.21,82 68.63,82 69.01,81.62 69.01,79.95 69.09,79.87
MP3
  Top 0.254: R19.1 38.84,61.34 39.27,60.91 40.45,60.91 C27.- 40.6,60.24 39.79,59.8 39.79,54.53 U2.3
MP3-CS
  Top 0.203: U4.23 59.21,82.39 59.64,82.82 59.64,84.82 60.27,85.46 66.07,85.46 66.65,84.87 66.65,79.39 65.25,77.99 65.25,74.87 64.9,74.51 63.3,74.51 62.76,73.98 62.76,72.5 62.94,72.33 64.39,72.33 65.4,71.31 65.4,69.18 U5.10
MP3-DCS
  Top 0.203: U4.13 59.48,77.39 60.38,76.49 60.38,74.61 60.78,74.21 61.85,74.21 62.13,73.93 62.13,72.35 62.59,71.9 63.88,71.9 64.54,71.23 64.54,69.21 U5.11
MP3-DREQ  (via drill 0.5)
  Top 0.203: v54.2,73.83 54.2,74.66 53.87,74.99 U4.8
  Top 0.254: U5.32 66.19,59.66 66.34,59.5 67.44,59.5 v67.82,59.88 | v69.62,73.22 65.25,73.22 v64.97,73.5
  Bottom 0.254: v67.82,59.88 68.58,59.88 69.09,60.39 69.09,72.68 v69.62,73.22 | v64.97,73.5 64.97,73.11 64.67,72.81 60.1,72.81 59.33,73.57 54.46,73.57 v54.2,73.83
MP3-MIDI-RX  (via drill 0.5)
  Top 0.203: U4.26 55.37,83.35 56.02,82.7 56.02,80.94 55.35,80.26 55.35,79.29 v55.14,79.08 | SJ3.1 50.86,65.83 R20.1 50.86,65.82 49.07,65.82 48.77,66.13 v48.77,70.65
  Bottom 0.203: v55.14,79.08 52.35,79.08 51.82,78.52 51.69,78.4 51.69,76.57 52.1,76.16 52.58,76.16 52.76,75.98 52.76,73.57 52.4,73.22 51.26,73.22 50.77,73.7 49.45,73.7 49.28,73.52 49.28,71.16 v48.77,70.65
MP3-RST
  Top 0.203: 63.64,69.58 63.79,69.44 U5.12 63.8,69.18 63.8,70.6 62.97,71.44 52.7,71.44 52.4,71.74 52.4,72.38 51.87,72.91 R22.2 50.9,74.44 51.37,74.91 U4.3
N$1
  Top 0.305: U1.12 65.52,36.49 66.42,37.39 67.76,37.39 L1.1 67.72,37.51 C3.1
N$2
  Top 0.305: A1.S 74.68,37.73 69.84,37.73 69.8,37.69 L1.2 69.75,37.47 C2.1
N$3
  Top 0.813: L2.2 57.05,8.7 C1.1 60.45,8.71 60.72,8.45 60.29,8.45 C4.A 67.81,8.68 69.77,10.64 69.77,15.5 U1.8
N$4  (via drill 0.6)
  Top 0.254: v66.32,15.6 66.32,13.95 U1.7
  Bottom 0.254: SJ1.2 64.29,15.6 64.54,15.34 66.07,15.34 v66.32,15.6
N$5
  Top 0.305: U12.7 36.8,41.72 D1.2
N$6
  Top 0.254: R13.1 27.24,49.16 IC1.6 25.01,49.19 23.14,49.19 21.89,50.43 IC1.2 19.78,50.46 16.83,50.46 C15.1
N$8  (via drill 0.6)
  Top 0.305: v51.04,25.36 48.21,25.36 47.55,26.02 47.55,31.64 46.94,32.25 47.52,32.25 U1.16
  Bottom 0.305: R4.1 45.52,24.55 Q2.2 47.58,24.55 48.01,24.97 50.65,24.97 v51.04,25.36
N$9  (via drill 0.6)
  Top 0.305: v43.23,29.85 U1.17
  Bottom 0.305: Q1.2 45.4,28.78 | 45.4,28.78 R3.1 | 45.4,28.78 44.02,28.78 43.23,29.57 v43.23,29.85
N$14  (via drill 0.6)
  Top 0.305: C35.2 30,39.71 v29.62,39.33 | v31,17.7 45.85,17.7 47.56,15.99 47.56,13.06 47.14,12.64 47.14,12.67 U1.3
  Bottom 0.305: v29.62,39.33 29.62,32.53 32.03,30.11 32.03,18.73 v31,17.7
N$16  (via drill 0.6)
  Top 0.406: R34.1 26.6,12.27 | 26.6,12.27 U14.3 | R31.2 26.49,8 v26.86,7.63 | v26.97,13.73 v26.96,13.73 26.73,13.5 26.73,12.4 26.6,12.27
  Bottom 0.406: v26.86,7.63 26.86,13.61 v26.97,13.73
N$17
  Top 0.305: C35.1 30,45.96 30.53,46.5 32.44,46.5 34.48,48.54 36.2,48.54 R30.1
N$18
  Top 0.203: R10.2 61.83,80.8 62.08,81.04 62.08,81.66 Y2.3
  Top 0.254: U4.18 58.08,79.89 58.93,80.73 59.78,80.73 R10.2 | Y2.3 62.15,83.88 C17.2
N$19  (via drill 0.6)
  Top 0.254: U8.3 52.36,44.42 52.81,44.87 54.32,44.87 54.79,44.4 54.79,42.52 55.18,42.13 55.91,42.13 56.25,41.78 56.25,40.46 v56.27,40.39
  Bottom 0.254: v56.27,40.39 56.25,40.35 55.97,40.06 54.48,40.06 53.9,39.47 53.9,26.14 54.52,25.51 55.33,25.51 R16.1
N$20  (via drill 0.5)
  Top 0.254: v31.37,16.09 31.37,12.64 C38.C
  Bottom 0.254: R40.E 71.16,55.68 48.82,55.68 48.2,55.05 48.2,51.97 46.79,50.56 38.9,50.56 38.16,49.82 38.16,48.3 37.11,47.24 32.74,47.24 28.63,43.13 28.63,32.35 31.01,29.96 31.01,19.06 29.95,18 29.95,16.7 30.33,16.32 31.14,16.32 v31.37,16.09
N$21
  Top 0.305: D1.1 36.7,42.99 U12.6 U12.3 R12.2 C12.1
N$22
  Top 0.254: 29.35,50.55 29.62,50.55 29.87,50.8 30.86,50.8 R15.1 | 29.35,50.55 25.15,50.55 IC1.7 | R14.1 29.14,50.75 29.35,50.55
N$23
  Top 0.254: R13.2 30.77,49.11 R15.2
N$24
  Top 0.254: IC1.5 C13.1
N$25
  Bottom 0.254: Q3.1 55.45,23.6 R16.2
N$26
  Top 0.254: IC1.3 18.17,49.16 17.96,48.95 17.96,45.71 17.73,45.48 17.85,45.48 C14.A
N$27
  Top 0.254: R17.1 75.07,29.12 LED4.A
N$28  (via drill 0.6)
  Top 0.254: U8.22 61.74,36.22 61.95,36.44 62.27,36.44 v62.28,36.42 | v71.49,32.41 72.75,32.41 73.02,32.13 73.02,31.42 R17.2
  Bottom 0.254: v62.28,36.42 62.28,32.37 62.69,31.97 71.04,31.97 v71.49,32.41
N$29
  Top 0.203: R10.1 60.69,79 61.16,79.46 63.55,79.46 64.21,78.8 64.21,78.27 Y2.1
  Top 0.254: U4.17 58.69,79.39 59.11,78.97 59.82,78.97 R10.1 | C18.2 64.13,77.1 64.5,77.47 64.5,77.98 Y2.1
N$30
  Top 0.254: R18.1 45.6,63.43 C27.+ C16.1
N$31
  Top 0.406: U13.1 R35.1 R32.2
N$32  (via drill 0.6)
  Top 0.254: U4.44 50.06,79.39 v50.49,78.93
  Bottom 0.254: v50.49,78.93 50.49,78.45 50.24,78.19 C19.2
N$33
  Top 0.406: C38.A 30.7,9.17 26.24,9.17 25.94,9.47 U14.1 25.92,9.69 24.7,9.69 24.62,9.77 24.62,12.1 25.27,12.75 R37.2
N$34
  Top 0.254: C22.1 39.61,69.48 R25.1
N$35
  Top 0.254: C21.1 46.15,69.5 R24.1
N$36
  Top 0.254: C20.1 R23.1
N$37
  Top 0.406: R38.2 U14.4 23.47,11.74 R37.1
N$38
  Top 0.406: C36.C 19.54,11.89 R38.1
N$40  (via drill 0.6)
  Top 0.254: U8.17 57.01,37.83 v57.47,38.29
  Bottom 0.254: v57.47,38.29 57.47,38.98 57.05,39.4 55.02,39.4 54.56,38.94 54.56,28.61 56.81,26.37 71.07,26.37 71.89,25.54 71.89,21.59 72.53,20.96 74.52,20.96 ICSP.4 74.59,21.04
N$41
  Top 0.203: U5.7 68.34,66.87 69.19,66.03 Y1.1
N$42
  Top 0.203: U5.8 68.42,67.67 69.19,68.44 Y1.3
N$43  (via drill 0.6)
  Top 0.254: U8.16 56.21,37.66 v55.63,38.24
  Bottom 0.254: v55.63,38.24 55.63,28.42 57.05,27 73.08,27 74.36,25.72 74.36,23.58 ICSP.5 74.23,23.69
N$44
  Top 0.254: R36.1 72.85,92.46 LED1.A
N$46  (via drill 0.5)
  Top 0.254: U8.18 57.81,37.25 58.22,37.66 60.65,37.66 60.96,37.96 60.96,39.94 v60.81,40.09 | v72.39,29.27 72.08,28.97 72.08,13.88 72.58,13.39 74.32,13.39 ICSP.1
  Bottom 0.254: v60.81,40.09 69.49,40.09 70.26,40.86 | 70.26,40.86 70.26,46.8 71.32,47.87 74.37,47.87 74.98,48.48 74.98,49.6 S3.2 | v72.39,29.27 72.85,29.73 72.85,33.54 72.24,34.15 72.24,40.09 71.48,40.86 70.26,40.86 | R8.1 71.5,13.45 71.73,13.22 74.15,13.22 ICSP.1
N$47
  Top 0.254: R42.1 73.74,68.16 LED2.R
N$48
  Top 0.305: U1.18 38.82,34.37 C42.1
N$49  (via drill 0.5)
  Top 0.254: v75.13,69.66 75.13,71.16 LED2.B
  Bottom 0.254: R43.1 75.45,69.34 v75.13,69.66
N$50  (via drill 0.5)
  Top 0.254: v73.76,69.66 73.76,71.13 LED2.G
  Bottom 0.254: R44.1 73.79,69.33 v73.76,69.66
N$51
  Top 0.203: U5.26 61.39,61.45 61.59,61.66 66.57,61.66 67.03,61.2 69.29,61.2 69.44,61.35 69.44,63.31 69.88,63.74 71.12,63.74 71.96,64.58 73.7,64.58 R42.2
N$52  (via drill 0.5)
  Top 0.254: v62.18,58.38 62.18,60.57 U5.27
  Bottom 0.254: R43.2 75.45,64.8 73.46,62.8 70.71,62.8 70.41,62.5 70.41,59.6 68.71,57.87 62.66,57.87 v62.18,58.38
N$53  (via drill 0.5)
  Top 0.254: v63.09,59.25 63.09,60.47 U5.28
  Bottom 0.254: R44.2 73.79,64.05 73.15,63.41 70.41,63.41 69.8,62.8 69.8,59.91 68.43,58.53 63.27,58.53 63.09,58.71 v63.09,59.25
N$54
  Top 0.254: LED3.A 66.39,88.19 R45.1
N$55
  Top 0.254: LED5.A R46.1
N$73
  Top 0.254: U4.36 50.37,85.08 49.07,86.39 49.07,86.88 R29.2
N$86
  Top 0.305: TX1.A R81.1
N$87
  Top 0.305: RX1.A R82.1
PTT  (via drill 0.6)
  Top 0.254: 56.57,13.79 56.08,13.31 56.46,13.31 U1.5
  Top 0.406: 56.57,13.79 v56.57,16.31
  Bottom 0.254: Q3.3 56.4,16.47 v56.57,16.31
  Bottom 0.406: JP7.2 57.62,10.31 56.24,11.7 56.24,15.98 v56.57,16.31
RIGHT
  Top 0.254: U4.39 46.64,81.89 45.44,80.7 45.45,76.47 44.96,75.96 41.72,75.96 40.49,74.71 JP1.1 39.64,72.68 R25.2
RS485-A  (via drill 0.6)
  Top 0.254: CARD1.3 9.92,83.82 v10.2,83.54
  Bottom 0.254: v10.2,83.54 10.2,80.29 11.1,79.39 16,79.39 16.94,78.45 U11.6
RS485-B  (via drill 0.6)
  Top 0.254: 11.85,81.18 11.95,81.18 v11.95,81.19
  Top 0.406: CARD1.4 11.85,81.28 11.85,81.18
  Bottom 0.254: v11.95,81.19 17.09,81.19 18.19,80.1 18.19,74.56 U11.7
RST  (via drill 0.5)
  Top 0.203: v60.76,58.1 60.76,57.72 60.93,57.54 63.45,57.54 63.96,58.05 63.96,59.73 63.78,59.91 U5.29
  Bottom 0.203: 57.81,65.6 54.9,65.6 JP9.5 | R33.1 57.94,61.86 58.55,61.25 60.27,61.25 61.42,60.11 61.42,58.76 v60.76,58.1
  Bottom 0.254: R33.1 57.9,65.58 57.81,65.6
RX1  (via drill 0.5)
  Top 0.254: U8.1 51.21,46.35 51.97,47.1 51.97,57.72 v51.61,58.26 51.61,61.51 52.1,62.09 56.31,62.09 57.02,61.33 57.02,60.42 TX1.C
  Bottom 0.254: v51.61,58.26 37.19,58.23 35.2,60.21 35.2,75.3 34.9,75.6 34.9,87.87 37.46,90.44 37.46,94.48 36.68,95.26 22.55,95.26 21.59,94.27 21.59,71.41 20.32,70.14 19.56,70.14 19.47,70.05 U11.1
RX2  (via drill 0.6)
  Top 0.254: v53.35,41.95 52.91,42.39 52.43,42.84 51.22,42.84 U8.5
  Bottom 0.254: 51.39,23.6 51.88,23.6 52.18,23.9 52.18,41.54 52.6,41.96 52.96,41.96 v53.35,41.95
  Bottom 0.305: Q2.3 51.39,23.6 R1.1
S0
  Top 0.254: U5.23 58.13,62.87 57.76,62.5 57.76,61.58 58.37,61.13 58.37,53.51 55.47,50.61 55.47,47.89 U8.41
S1
  Top 0.254: U5.24 59.09,53.16 56.24,50.31 56.24,47.85 U8.40
S2
  Top 0.254: U8.39 57.01,49.86 59.77,52.62 59.77,61.28 60.2,61.74 60.2,62.83 60.78,63.41 64.03,63.41 64.44,63.82 64.44,66.74 65.07,67.37 65.84,67.37 66.14,67.68 66.14,69.12 U5.9
SCK  (via drill 0.5)
  Top 0.203: U4.28 54.37,83.68 54.58,83.46 54.58,82.46 v54.98,82.11 | JP9.3 54.88,68.11 57.05,68.11 57.48,67.68 58.55,67.68 | U5.17 59.07,67.65 58.57,67.65 58.55,67.68 | 58.55,67.68 58.62,67.68 58.65,67.7 58.65,68.9 v58.24,69.3
  Bottom 0.203: 71.34,82.12 U7.5 70.36,82.26 70,82.61 55.35,82.61 54.98,82.25 v54.98,82.11 54.93,82.06 53.14,82.06 52.53,81.45 52.53,80.79 52.88,80.43 55.73,80.43 56.62,81.32 66.19,81.32 66.73,80.79 66.73,72.05 66.42,71.74 62.79,71.74 61.24,70.19 61.24,69.51 61.04,69.3 v58.24,69.3
SD-CS  (via drill 0.5)
  Top 0.203: v63.03,67.64 63.03,69.12 U5.13
  Bottom 0.203: U7.2 69.15,78.95 67.82,77.62 67.82,71.22 67.35,70.75 63.45,70.75 63.02,70.32 63.02,67.65 v63.03,67.64
TONE-OUT  (via drill 0.6)
  Top 0.254: C14.C 22.85,45.15 23.52,44.48 27.77,44.48 28.77,45.47 28.77,47.16 29.26,47.65 31.74,47.65 32.16,48.07 32.16,50.46 32.75,51.05 34.06,51.05 v34.3,51.03 | v43.59,55.82 43.64,55.82 44.6,54.85 44.6,53.74 U6.3
  Bottom 0.254: v34.3,51.03 43.14,51.04 43.83,51.73 43.83,55.58 v43.59,55.82
TRIG4/TXO  (via drill 0.5)
  Top 0.203: U5.31 65.39,55.47 JP2.1 | SJ3.2 50.85,63.58 50.62,63.36 50.62,54.9 v50.85,54.67
  Bottom 0.203: v50.85,54.67 66.18,54.67 JP2.1
TRIG5/RXI
  Top 0.203: U5.30 64.59,52.17 65.28,51.47 JP2.2
TX1  (via drill 0.5)
  Top 0.254: U8.44 53.01,58.86 v52.68,59.27 52.58,59.27 52.65,59.55 52.65,61.1 53.01,61.53 54.56,61.53 55.09,61 55.09,60.42 RX1.C
  Bottom 0.254: U11.4 15.66,70.04 15.7,70.08 15.7,70.65 16.18,71.13 20.35,71.13 20.95,71.74 20.98,94.68 22.15,95.85 37.36,95.85 38,95.21 38.02,90.03 35.48,87.49 35.48,76.39 36.12,75.76 36.12,60.67 37.49,59.3 v52.68,59.27
TX2  (via drill 0.6)
  Top 0.254: v53.39,43.65 51.24,43.65 U8.4
  Bottom 0.254: R2.1 51.23,42.95 51.92,43.64 53.38,43.64 v53.39,43.65
  Bottom 0.305: Q1.3 51.22,27.83 R2.1
U11-RE/DE  (via drill 0.5)
  Top 0.254: U8.43 53.81,58.67 v53.8,60.52
  Bottom 0.254: U11.3 U11.2 17.08,69.32 16.94,69.18 16.94,67.88 16.51,67.45 14.96,67.45 14.53,67.88 14.53,70.6 15.67,71.74 20.12,71.74 20.45,72.07 20.45,94.96 21.92,96.43 37.74,96.43 38.66,95.52 38.66,89.45 36.12,86.91 36.12,77.13 37.08,76.21 37.03,61.43 37.95,60.52 v53.8,60.52
V+  (via drill 0.6)
  Top 0.254: R46.2 63.93,90.34 63.25,91.02 63.25,94.31 62.81,94.74 36.61,94.74 v35.76,93.89
  Top 0.813: L2.1 47.93,8.7 v47.51,8.28
  Bottom 0.254: v35.76,93.89 34.42,93.89 33.53,93 33.53,73.91 32.99,73.38 32.99,72.4 v33.25,72.15 | Q2.1 47.36,22.65 47.56,22.44
  Bottom 0.305: Q1.1 R3.2 43.42,26.87 43.08,26.53 43.08,23.03 43.44,22.66 R4.2 45.44,22.65 Q2.1 | 47.56,22.44 47.56,8.15 47.24,7.83
  Bottom 0.813: v47.51,8.28 47.51,8.1 47.24,7.83 46.43,7.02 33.46,7.02 32.11,5.66 32.11,5.6 31.69,5.18 15.8,5.18 14,6.99 14,7.1 13.75,7.34 13.75,62.78 15.87,64.9 23.99,64.9 24.93,65.84 24.93,68.48 25.07,68.62 25.07,68.96 v24.84,69.19
  other vias: 23.7,72.96 25.95,72.97 28.17,73 24.84,71.67 27.14,71.62 23.67,70.36 25.95,70.49 28.17,70.42 27.05,69.11 30.1,73.1 30.07,71.13 31.53,71.97 31.48,70.5 33.21,70.64 30.11,69.16 33.4,69.09
  pour Top (no thermals): 22.81,67.54 33.53,67.54 34.04,68.05 34.04,73.19 33.27,73.95 23.13,73.95 22.57,73.39 22.57,67.79 22.8,67.55
  pour Bottom: 22.53,73.43 22.59,73.43 23.13,73.96 33.21,73.96 34.01,73.16 34.01,68.05 33.55,67.59 22.81,67.59 22.56,67.84
VD
  Top 0.254: U12.1 43.85,34.93 44.65,34.13 58.83,34.13 59.44,34.73 59.44,36.2 U8.20
  Top 0.305: U12.2 U12.1
VXD  (via drill 0.6)
  Top 0.305: U1.2 43.22,15.1 v42.39,15.93 | v49.49,39.57 51.16,39.57 U8.9
  Bottom 0.305: v42.39,15.93 42.39,20.9 41.63,21.67 41.63,31.93 42.39,32.69 49.02,32.69 49.69,33.36 49.69,39.37 v49.49,39.57